# Altium project CourseEN.PrjPcb (part 1 of 2)
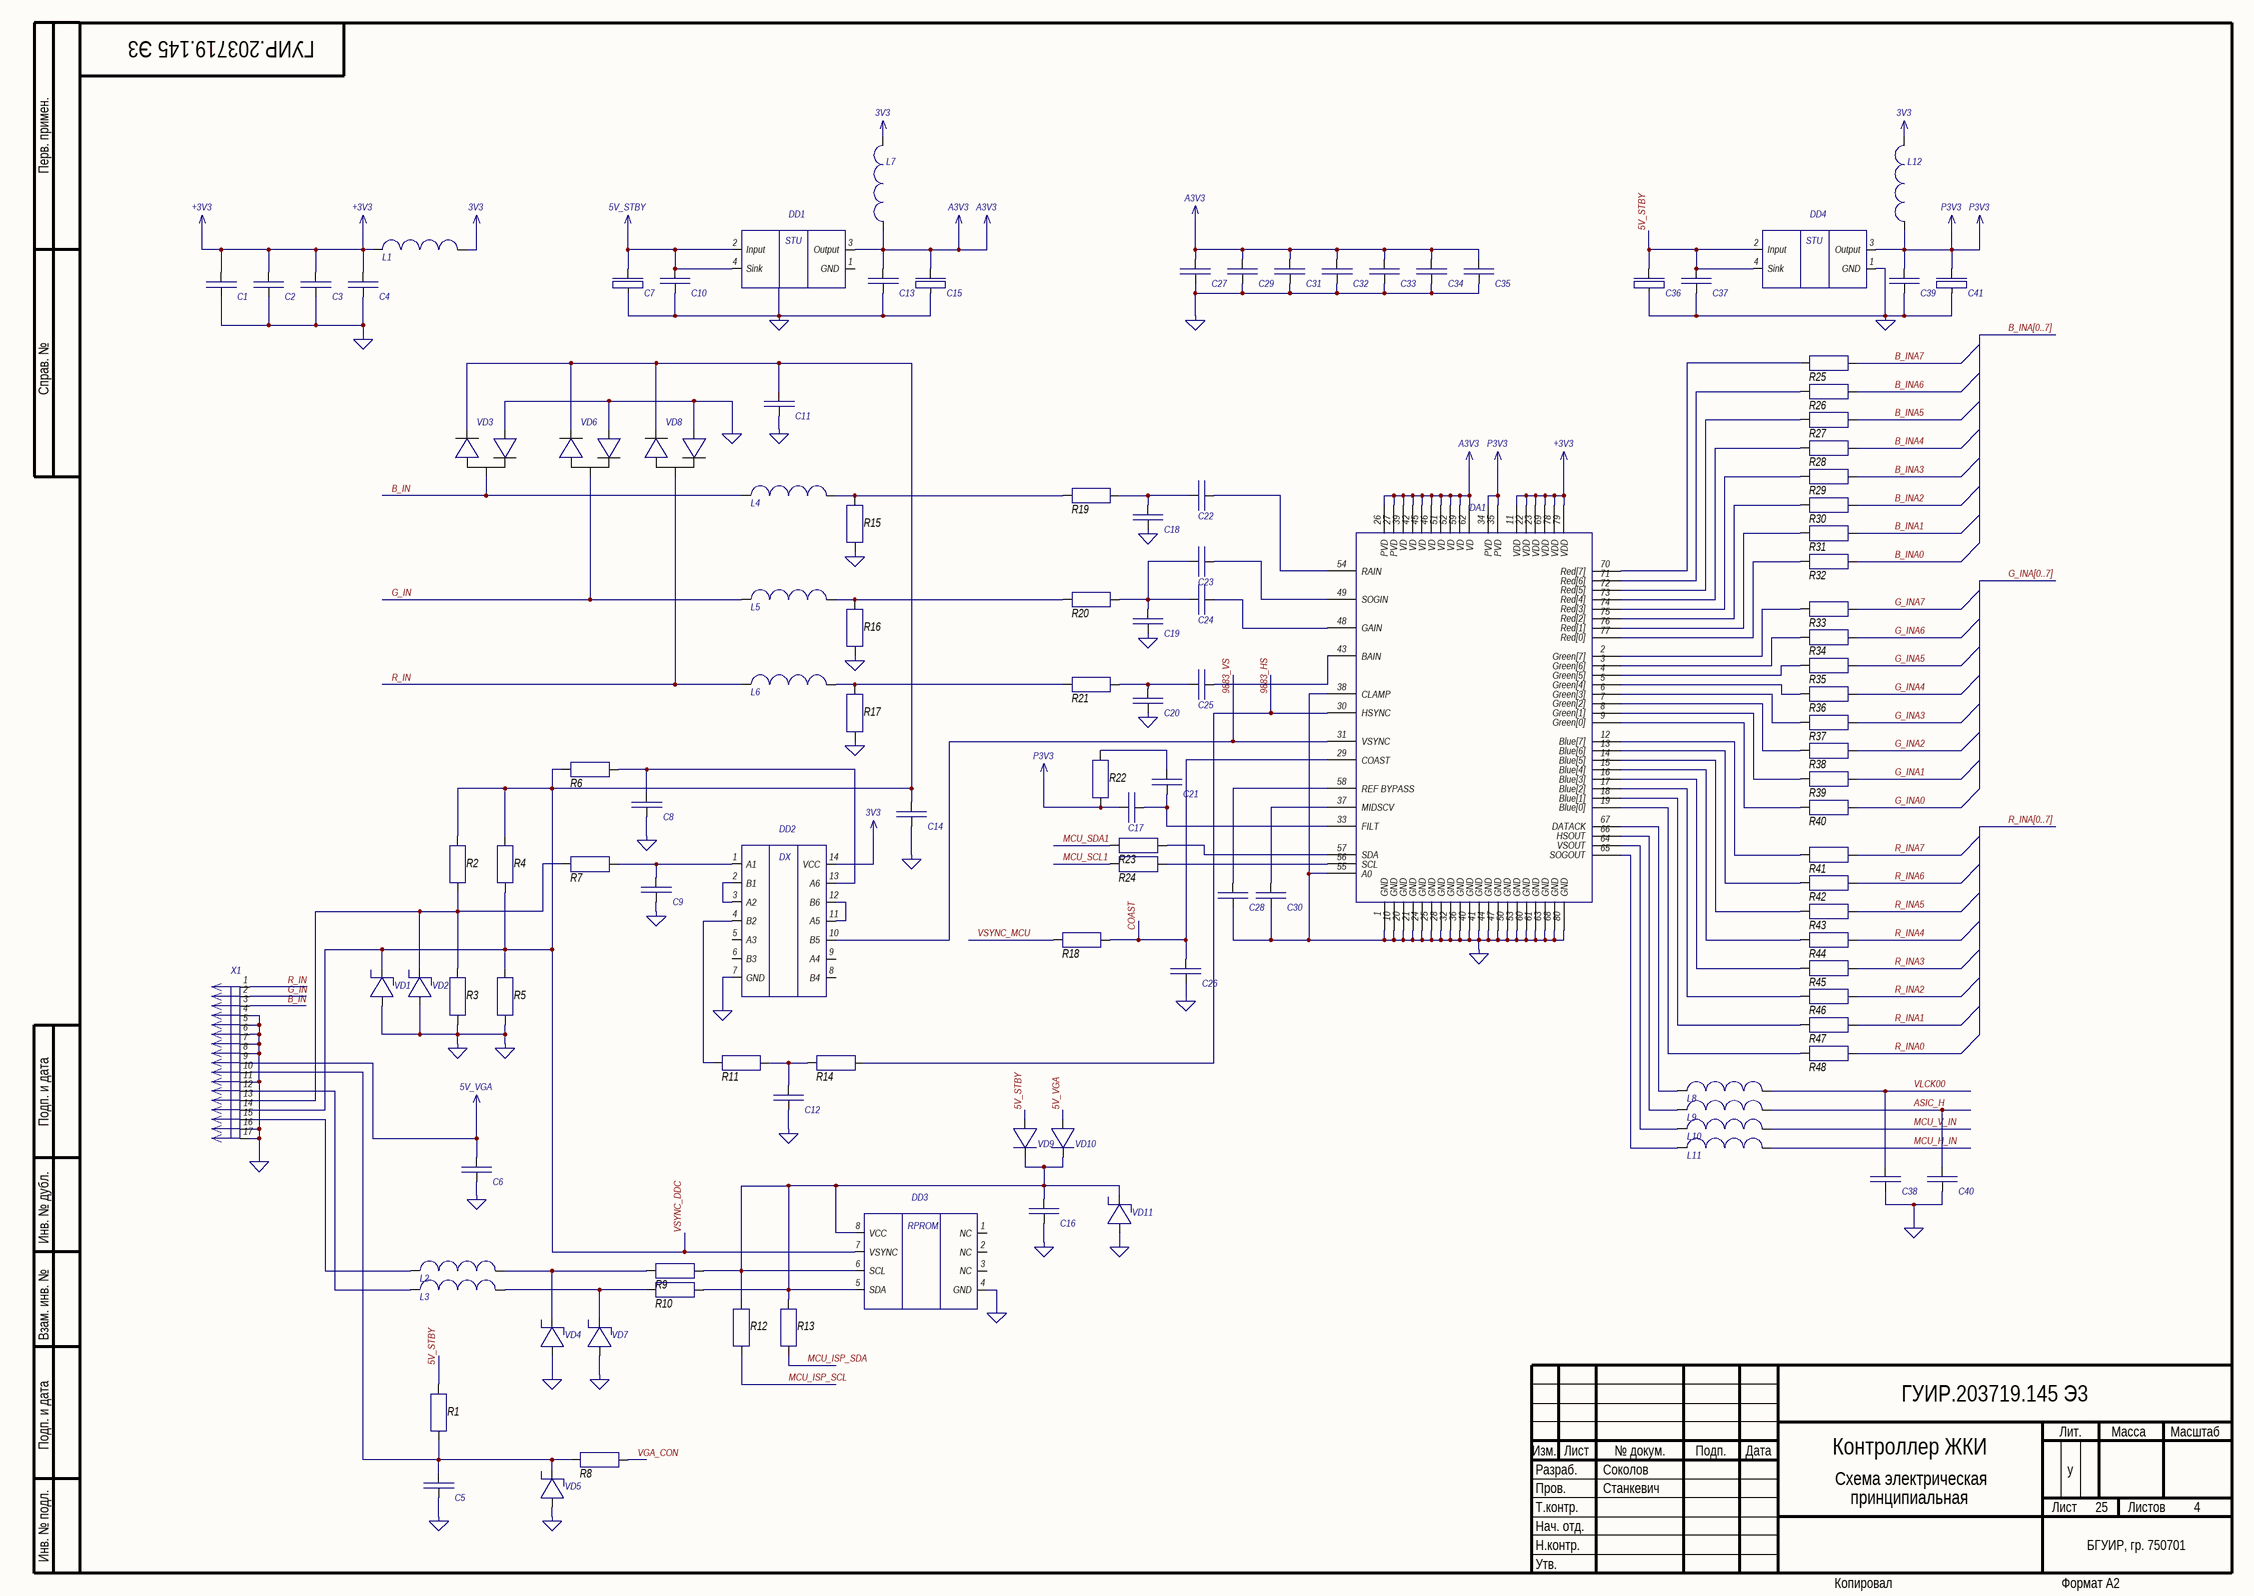
[diagram p0: 31.SchDoc]
4 sheets, 511 parts. Net scope: global (net labels, ports and power ports of the same name join across sheets).
Board files: PCB_with_drawing_try2.PcbDoc, PCB_assembly_drawing_try2.PcbDoc
Sheets:
  31.SchDoc
  32.SchDoc
  33.SchDoc
  36.SchDoc

## Sheet 31.SchDoc
size 594 x 420 mm; Scale: 1:1; Разраб.: Соколов; Обозначение документа: ГУИР.203719.145 Э3; Пров.: Станкевич; Номер листа: 25; Общее количество листов: 4; Литера: у; Наименование организации: БГУИР, гр. 750701; Наименование изделия 1: Контроллер ЖКИ; Наименование изделия 2: Схема электрическая; Наименование изделия 3: принципиальная; Нач. отд.: Нач. отд.

### Parts
C1  Capacitor  [cap_electro_13]  (value not drawn)
C2  Capacitor  [cap_electro_13]  (value not drawn)
C3  Capacitor  [cap_electro_13]  (value not drawn)
C4  Capacitor  [cap_electro_13]  (value not drawn)
C5  Capacitor  [cap_electro_13]  (value not drawn)
C6  Capacitor  [cap_electro_13]  (value not drawn)
C7  TuningCapacitor  [Cap_tantal_D]  (value not drawn)
C8  Capacitor  [cap_electro_13]  (value not drawn)
C9  Capacitor  [cap_electro_13]  (value not drawn)
C10  Capacitor  [cap_electro_13]  (value not drawn)
C11  Capacitor  [cap_electro_13]  (value not drawn)
C12  Capacitor  [cap_electro_13]  (value not drawn)
C13  Capacitor  [cap_electro_13]  (value not drawn)
C14  Capacitor  [cap_electro_13]  (value not drawn)
C15  TuningCapacitor  [Cap_tantal_D]  (value not drawn)
C16  Capacitor  [cap_electro_13]  (value not drawn)
C17  Capacitor  [cap_electro_13]  (value not drawn)
C18  Capacitor  [cap_electro_13]  (value not drawn)
C19  Capacitor  [cap_electro_13]  (value not drawn)
C20  Capacitor  [cap_electro_13]  (value not drawn)
C21  Capacitor  [cap_electro_13]  (value not drawn)
C22  Capacitor  [cap_electro_13]  (value not drawn)
C23  Capacitor  [cap_electro_13]  (value not drawn)
C24  Capacitor  [cap_electro_13]  (value not drawn)
C25  Capacitor  [cap_electro_13]  (value not drawn)
C26  Capacitor  [cap_electro_13]  (value not drawn)
C27  Capacitor  [cap_electro_13]  (value not drawn)
C28  Capacitor  [cap_electro_13]  (value not drawn)
C29  Capacitor  [cap_electro_13]  (value not drawn)
C30  Capacitor  [cap_electro_13]  (value not drawn)
C31  Capacitor  [cap_electro_13]  (value not drawn)
C32  Capacitor  [cap_electro_13]  (value not drawn)
C33  Capacitor  [cap_electro_13]  (value not drawn)
C34  Capacitor  [cap_electro_13]  (value not drawn)
C35  Capacitor  [cap_electro_13]  (value not drawn)
C36  TuningCapacitor  [Cap_tantal_D]  (value not drawn)
C37  Capacitor  [cap_electro_13]  (value not drawn)
C38  Capacitor  [cap_electro_13]  (value not drawn)
C39  Capacitor  [cap_electro_13]  (value not drawn)
C40  Capacitor  [cap_electro_13]  (value not drawn)
C41  TuningCapacitor  [Cap_tantal_D]  (value not drawn)
DA1  AD9883ABSTZ-140  [ST_80_2_ADI]  (value not drawn)
DD1  AIC1732  [AIC1732(SOT-89)]  (value not drawn)
DD2  74LVX14  [74LVX14(SO-14)]  (value not drawn)
DD3  24C21  [24Cxx]  (value not drawn)
DD4  AIC1732  [AIC1732(SOT-89)]  (value not drawn)
L1  Inductor  [inductor]  (value not drawn)
L2  Inductor  [inductor]  (value not drawn)
L3  Inductor  [inductor]  (value not drawn)
L4  Inductor  [inductor]  (value not drawn)
L5  Inductor  [inductor]  (value not drawn)
L6  Inductor  [inductor]  (value not drawn)
L7  Inductor  [inductor]  (value not drawn)
L8  Inductor  [inductor]  (value not drawn)
L9  Inductor  [inductor]  (value not drawn)
L10  Inductor  [inductor]  (value not drawn)
L11  Inductor  [inductor]  (value not drawn)
L12  Inductor  [inductor]  (value not drawn)
R1  Resistor  [R_1206]  (value not drawn)
R2  Resistor  [R_1206]  (value not drawn)
R3  Resistor  [R_1206]  (value not drawn)
R4  Resistor  [R_1206]  (value not drawn)
R5  Resistor  [R_1206]  (value not drawn)
R6  Resistor  [R_1206]  (value not drawn)
R7  Resistor  [R_1206]  (value not drawn)
R8  Resistor  [R_1206]  (value not drawn)
R9  Resistor  [R_1206]  (value not drawn)
R10  Resistor  [R_1206]  (value not drawn)
R11  Resistor  [R_1206]  (value not drawn)
R12  Resistor  [R_1206]  (value not drawn)
R13  Resistor  [R_1206]  (value not drawn)
R14  Resistor  [R_1206]  (value not drawn)
R15  Resistor  [R_1206]  (value not drawn)
R16  Resistor  [R_1206]  (value not drawn)
R17  Resistor  [R_1206]  (value not drawn)
R18  Resistor  [R_1206]  (value not drawn)
R19  Resistor  [R_1206]  (value not drawn)
R20  Resistor  [R_1206]  (value not drawn)
R21  Resistor  [R_1206]  (value not drawn)
R22  Resistor  [R_1206]  (value not drawn)
R23  Resistor  [R_1206]  (value not drawn)
R24  Resistor  [R_1206]  (value not drawn)
R25  Resistor  [R_1206]  (value not drawn)
R26  Resistor  [R_1206]  (value not drawn)
R27  Resistor  [R_1206]  (value not drawn)
R28  Resistor  [R_1206]  (value not drawn)
R29  Resistor  [R_1206]  (value not drawn)
R30  Resistor  [R_1206]  (value not drawn)
R31  Resistor  [R_1206]  (value not drawn)
R32  Resistor  [R_1206]  (value not drawn)
R33  Resistor  [R_1206]  (value not drawn)
R34  Resistor  [R_1206]  (value not drawn)
R35  Resistor  [R_1206]  (value not drawn)
R36  Resistor  [R_1206]  (value not drawn)
R37  Resistor  [R_1206]  (value not drawn)
R38  Resistor  [R_1206]  (value not drawn)
R39  Resistor  [R_1206]  (value not drawn)
R40  Resistor  [R_1206]  (value not drawn)
R41  Resistor  [R_1206]  (value not drawn)
R42  Resistor  [R_1206]  (value not drawn)
R43  Resistor  [R_1206]  (value not drawn)
R44  Resistor  [R_1206]  (value not drawn)
R45  Resistor  [R_1206]  (value not drawn)
R46  Resistor  [R_1206]  (value not drawn)
R47  Resistor  [R_1206]  (value not drawn)
R48  Resistor  [R_1206]  (value not drawn)
VD1  DiodeSchottky  [zener_diode]  (value not drawn)
VD2  DiodeSchottky  [zener_diode]  (value not drawn)
VD3  BAV99  [BAV99]  (value not drawn)
VD4  DiodeSchottky  [zener_diode]  (value not drawn)
VD5  DiodeSchottky  [zener_diode]  (value not drawn)
VD6  BAV99  [BAV99]  (value not drawn)
VD7  DiodeSchottky  [zener_diode]  (value not drawn)
VD8  BAV99  [BAV99]  (value not drawn)
VD9  Diode  [zener_diode]  (value not drawn)
VD10  Diode  [zener_diode]  (value not drawn)
VD11  DiodeSchottky  [zener_diode]  (value not drawn)
X1  DB-15  [VGA]  (value not drawn)

### Nets
3V3: DD2.14(VCC) L1.2 L7.2 L12.2
5V_STBY: C7.1 C10.1 C36.1 C37.1 DD1.2(Input) DD1.4(Sink) DD4.2(Input) DD4.4(Sink) R1.2 VD9.1
5V_VGA: C6.2 VD10.1 X1.9
+3V3: C1.1 C2.1 C3.1 C4.1 DA1.11(VDD) DA1.22(VDD) DA1.23(VDD) DA1.69(VDD) DA1.78(VDD) DA1.79(VDD) L1.1
A3V3: C13.1 C15.1 C27.1 C29.1 C31.1 C32.1 C33.1 C34.1 C35.1 DA1.26(PVD) DA1.27(PVD) DA1.39(VD) DA1.42(VD) DA1.45(VD) DA1.46(VD) DA1.51(VD) DA1.52(VD) DA1.59(VD) DA1.62(VD) DD1.3(Output) L7.1
ASIC_H: C40.1 L9.2
GND: C1.2 C2.2 C3.2 C4.2 C5.2 C6.1 C7.2 C8.2 C9.2 C10.2 C11.2 C12.2 C13.2 C14.2 C15.2 C16.2 C18.2 C19.2 C20.2 C26.1 C27.2 C28.1 C29.2 C30.1 C31.2 C32.2 C33.2 C34.2 C35.2 C36.2 C37.2 C38.2 C39.2 C40.2 C41.2 DA1.1(GND) DA1.10(GND) DA1.20(GND) DA1.21(GND) DA1.24(GND) DA1.25(GND) DA1.28(GND) DA1.32(GND) DA1.36(GND) DA1.38(CLAMP) DA1.40(GND) DA1.41(GND) DA1.44(GND) DA1.47(GND) DA1.50(GND) DA1.53(GND) DA1.55(A0) DA1.60(GND) DA1.61(GND) DA1.63(GND) DA1.68(GND) DA1.80(GND) DD2.7(GND) DD3.4(GND) DD4.1(GND) R3.1 R5.1 R15.1 R16.1 R17.1 VD1.1 VD2.1 VD3.1 VD4.1 VD5.1 VD6.1 VD7.1 VD8.1 VD11.1 X1.4 X1.5 X1.6 X1.7 X1.8 X1.11 X1.16 X1.17
MCU_H_IN: L11.2
MCU_V_IN: L10.2
P3V3: C17.2 C39.1 C41.1 DA1.34(PVD) DA1.35(PVD) DD4.3(Output) L12.1 R22.1
VSYNC_MCU: R18.1
9883_HS: DA1.30(HSYNC) R14.2
9883_VS: DA1.31(VSYNC) DD2.10(B5)
B_IN: L4.1 VD3.3 X1.3
B_INA0: R32.2
B_INA1: R31.2
B_INA2: R30.2
B_INA3: R29.2
B_INA4: R28.2
B_INA5: R27.2
B_INA6: R26.2
B_INA7: R25.2
COAST: C26.2 DA1.29(COAST) R18.2
G_IN: L5.1 VD6.3 X1.2
G_INA0: R40.2
G_INA1: R39.2
G_INA2: R38.2
G_INA3: R37.2
G_INA4: R36.2
G_INA5: R35.2
G_INA6: R34.2
G_INA7: R33.2
MCU_ISP_SCL: R12.1
MCU_ISP_SDA: R13.1
MCU_SCL1: R24.1
MCU_SDA1: R23.1
R_IN: L6.1 VD8.3 X1.1
R_INA0: R48.2
R_INA1: R47.2
R_INA2: R46.2
R_INA3: R45.2
R_INA4: R44.2
R_INA5: R43.2
R_INA6: R42.2
R_INA7: R41.2
VGA_CON: R8.2
VLCK00: C38.1 L8.2
VSYNC_DDC: C11.1 C14.1 DD3.7(VSYNC) R2.2 R4.1 R4.2 R5.2 R6.1 VD1.2 VD3.2 VD6.2 VD8.2 X1.14
NetC5_1: C5.1 R1.1 R8.1 VD5.2 X1.10
NetC8_1: C8.1 DD2.13(A6) R6.2
NetC9_1: C9.1 DD2.1(A1) R7.2
NetC12_1: C12.1 R11.2 R14.1
NetC16_1: C16.1 DD3.5(SDA) DD3.6(SCL) DD3.8(VCC) R9.2 R10.2 R12.2 R13.2 VD9.2 VD10.2 VD11.2
NetC17_1: C17.1 C21.1 DA1.33(FILT)
NetC18_1: C18.1 C22.2 R19.2
NetC19_1: C19.1 C23.2 C24.2 R20.2
NetC20_1: C20.1 C25.2 R21.2
NetC21_2: C21.2 R22.2
NetC22_1: C22.1 DA1.54(RAIN)
NetC23_1: C23.1 DA1.49(SOGIN)
NetC24_1: C24.1 DA1.48(GAIN)
NetC25_1: C25.1 DA1.43(BAIN)
NetC28_2: C28.2 DA1.58(REF_BYPASS)
NetC30_2: C30.2 DA1.37(MIDSCV)
NetDA1_2: DA1.2(Green[7]) R33.1
NetDA1_3: DA1.3(Green[6]) R34.1
NetDA1_4: DA1.4(Green[5]) R35.1
NetDA1_5: DA1.5(Green[4]) R36.1
NetDA1_6: DA1.6(Green[3]) R37.1
NetDA1_7: DA1.7(Green[2]) R38.1
NetDA1_8: DA1.8(Green[1]) R39.1
NetDA1_9: DA1.9(Green[0]) R40.1
NetDA1_12: DA1.12(Blue[7]) R41.1
NetDA1_13: DA1.13(Blue[6]) R42.1
NetDA1_14: DA1.14(Blue[5]) R43.1
NetDA1_15: DA1.15(Blue[4]) R44.1
NetDA1_16: DA1.16(Blue[3]) R45.1
NetDA1_17: DA1.17(Blue[2]) R46.1
NetDA1_18: DA1.18(Blue[1]) R47.1
NetDA1_19: DA1.19(Blue[0]) R48.1
NetDA1_56: DA1.56(SCL) R24.2
NetDA1_57: DA1.57(SDA) R23.2
NetDA1_64: DA1.64(VSOUT) L10.1
NetDA1_65: DA1.65(SOGOUT) L11.1
NetDA1_66: DA1.66(HSOUT) L9.1
NetDA1_67: DA1.67(DATACK) L8.1
NetDA1_70: DA1.70(Red[7]) R25.1
NetDA1_71: DA1.71(Red[6]) R26.1
NetDA1_72: DA1.72(Red[5]) R27.1
NetDA1_73: DA1.73(Red[4]) R28.1
NetDA1_74: DA1.74(Red[3]) R29.1
NetDA1_75: DA1.75(Red[2]) R30.1
NetDA1_76: DA1.76(Red[1]) R31.1
NetDA1_77: DA1.77(Red[0]) R32.1
NetDD2_2: DD2.2(B1) DD2.3(A2)
NetDD2_4: DD2.4(B2) R11.1
NetDD2_11: DD2.11(A5) DD2.12(B6)
NetL2_1: L2.1 X1.15
NetL2_2: L2.2 R9.1 VD4.2
NetL3_1: L3.1 X1.12
NetL3_2: L3.2 R10.1 VD7.2
NetL4_2: L4.2 R15.2 R19.1
NetL5_2: L5.2 R16.2 R20.1
NetL6_2: L6.2 R17.2 R21.1
NetR2_1: R2.1 R3.2 R7.1 VD2.2 X1.13

Not connected (* = marked no-connect by the designer): DD1 1(GND); DD2 5(A3) 6(B3) 8(B4) 9(A4); DD3 1(NC) 2(NC) 3(NC)

### Buses and harness runs
bus B_INA[0..7]
bus G_INA[0..7]
bus R_INA[0..7]

### Notes on the sheet
- Перв. примен.
- Справ. №
- Подп. и дата
- Инв. № дубл.
- Взам. инв. №
- Разраб.
- Изм.
- Лист
- № докум.
- Подп.
- Дата
- Лит.
- Масса
- Масштаб
- Пров.
- Т.контр.
- Листов
- Инв. № подл.
- Утв.
- Н.контр.
- Копировал
- Формат А2
- (in symbol 24C21) RPROM
- (in symbol 74LVX14) DX
- (in symbol AIC1732) STU

### Library data of the parts
DA1 = AD9883ABSTZ-140: Built_By: EMA_UL_Team; Vendor: Analog Devices Inc; SourceLibrary: Analog_2012-01-01_6; Manufacturer_Part_Number: AD9883ABSTZ-140; Copyright: Copyright (C) 2018 Accelerated Designs. All rights reserved; RefDes: RefDes; Type: DEV
X1 = VGA_connector

## Sheet 32.SchDoc
size 594 x 420 mm; Scale: 1:1; Разраб.: Иванов; Обозначение документа: ГУИР.203719.145 Э3; Пров.: Петров; Утв.: Сидоров; Номер листа: 26; Наименование организации: ОАО "Концерн "МПО-Гидроприбор"; Наименование изделия 1: Плата; Наименование изделия 2: Схема электрическая; Наименование изделия 3: принципиальная; Нач. отд.: Нач. отд.; Фамилия нач. отд.: Сидоров
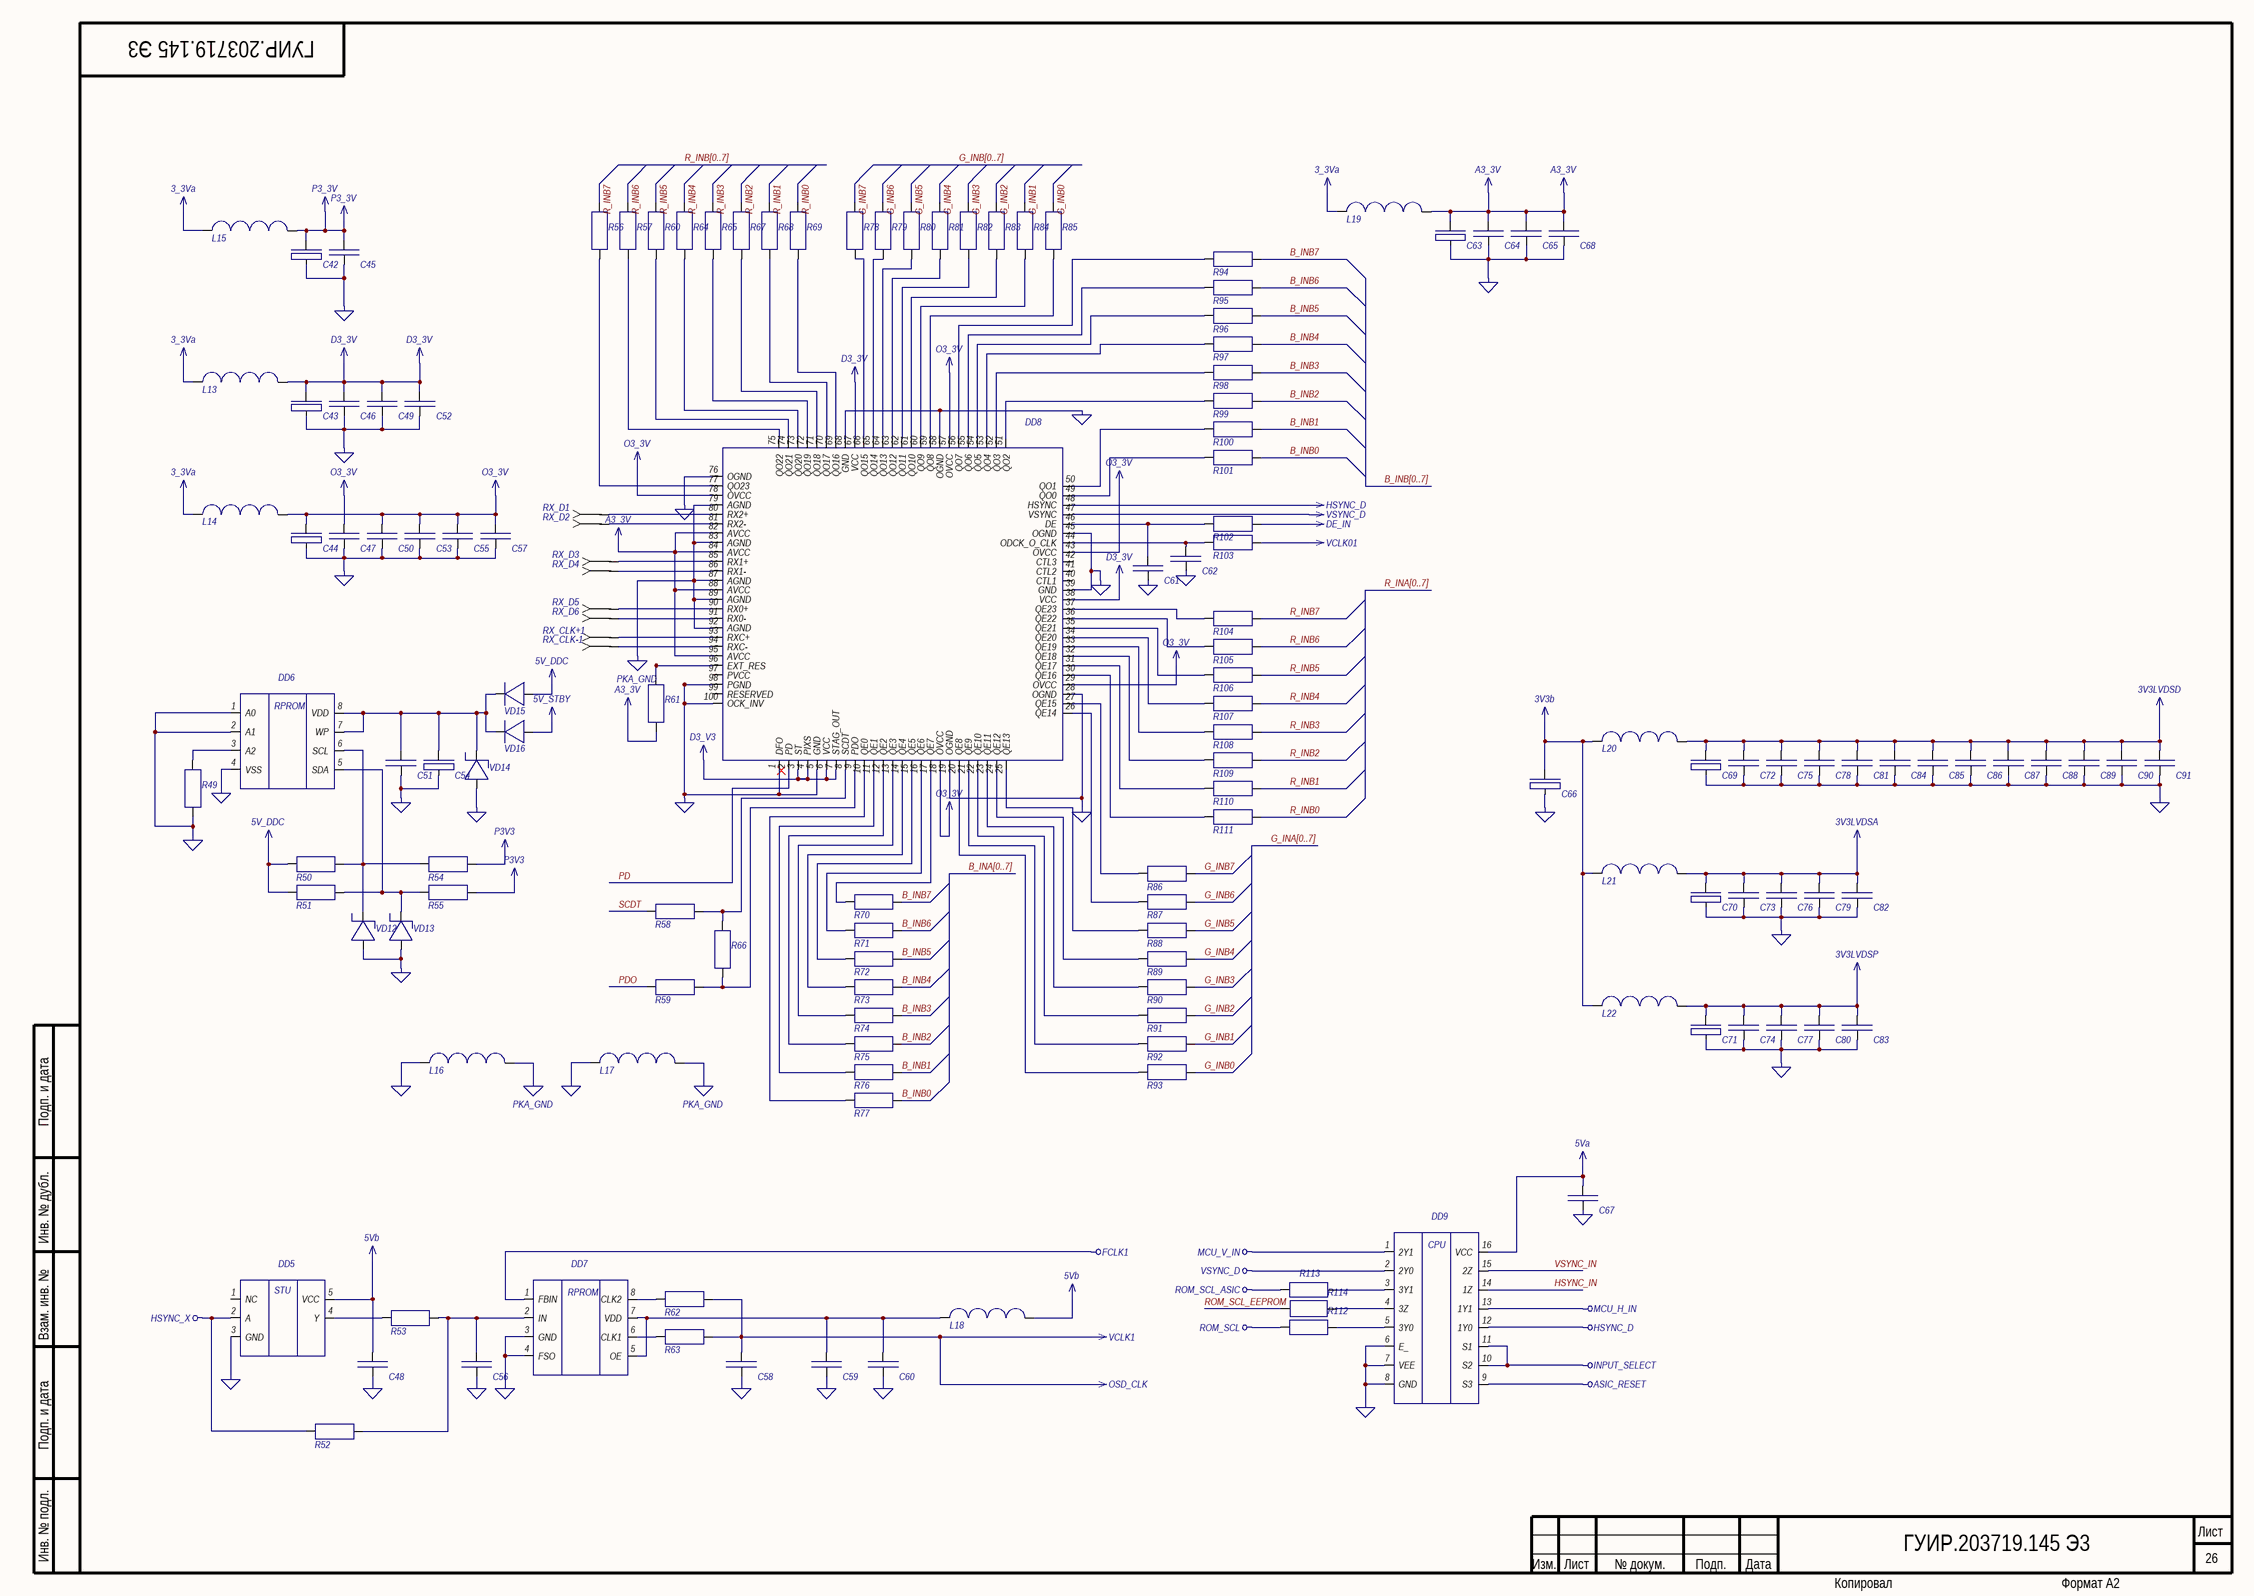
[diagram p1: 32.SchDoc]

### Parts
C42  TuningCapacitor  [Cap_tantal_D]  (value not drawn)
C43  TuningCapacitor  [Cap_tantal_D]  (value not drawn)
C44  TuningCapacitor  [Cap_tantal_D]  (value not drawn)
C45  Capacitor  [cap_electro_13]  (value not drawn)
C46  Capacitor  [cap_electro_13]  (value not drawn)
C47  Capacitor  [cap_electro_13]  (value not drawn)
C48  Capacitor  [cap_electro_13]  (value not drawn)
C49  Capacitor  [cap_electro_13]  (value not drawn)
C50  Capacitor  [cap_electro_13]  (value not drawn)
C51  Capacitor  [cap_electro_13]  (value not drawn)
C52  Capacitor  [cap_electro_13]  (value not drawn)
C53  Capacitor  [cap_electro_13]  (value not drawn)
C54  TuningCapacitor  [Cap_tantal_D]  (value not drawn)
C55  Capacitor  [cap_electro_13]  (value not drawn)
C56  Capacitor  [cap_electro_13]  (value not drawn)
C57  Capacitor  [cap_electro_13]  (value not drawn)
C58  Capacitor  [cap_electro_13]  (value not drawn)
C59  Capacitor  [cap_electro_13]  (value not drawn)
C60  Capacitor  [cap_electro_13]  (value not drawn)
C61  Capacitor  [cap_electro_13]  (value not drawn)
C62  Capacitor  [cap_electro_13]  (value not drawn)
C63  TuningCapacitor  [Cap_tantal_D]  (value not drawn)
C64  Capacitor  [cap_electro_13]  (value not drawn)
C65  Capacitor  [cap_electro_13]  (value not drawn)
C66  TuningCapacitor  [Cap_tantal_D]  (value not drawn)
C67  Capacitor  [cap_electro_13]  (value not drawn)
C68  Capacitor  [cap_electro_13]  (value not drawn)
C69  TuningCapacitor  [Cap_tantal_D]  (value not drawn)
C70  TuningCapacitor  [Cap_tantal_D]  (value not drawn)
C71  TuningCapacitor  [Cap_tantal_D]  (value not drawn)
C72  Capacitor  [cap_electro_13]  (value not drawn)
C73  Capacitor  [cap_electro_13]  (value not drawn)
C74  Capacitor  [cap_electro_13]  (value not drawn)
C75  Capacitor  [cap_electro_13]  (value not drawn)
C76  Capacitor  [cap_electro_13]  (value not drawn)
C77  Capacitor  [cap_electro_13]  (value not drawn)
C78  Capacitor  [cap_electro_13]  (value not drawn)
C79  Capacitor  [cap_electro_13]  (value not drawn)
C80  Capacitor  [cap_electro_13]  (value not drawn)
C81  Capacitor  [cap_electro_13]  (value not drawn)
C82  Capacitor  [cap_electro_13]  (value not drawn)
C83  Capacitor  [cap_electro_13]  (value not drawn)
C84  Capacitor  [cap_electro_13]  (value not drawn)
C85  Capacitor  [cap_electro_13]  (value not drawn)
C86  Capacitor  [cap_electro_13]  (value not drawn)
C87  Capacitor  [cap_electro_13]  (value not drawn)
C88  Capacitor  [cap_electro_13]  (value not drawn)
C89  Capacitor  [cap_electro_13]  (value not drawn)
C90  Capacitor  [cap_electro_13]  (value not drawn)
C91  Capacitor  [cap_electro_13]  (value not drawn)
DD5  F14-SINGLE  [74AHC1G14(SOT25)]  (value not drawn)
DD6  24C02  [24Cxx]  (value not drawn)
DD7  AV9173-01  [AV9173-01(DIP8)]  (value not drawn)
DD8  SIL151  [SIL151]  (value not drawn)
DD9  74LV4053  [74LV4053(SOT38-4)]  (value not drawn)
L13  Inductor  [inductor]  (value not drawn)
L14  Inductor  [inductor]  (value not drawn)
L15  Inductor  [inductor]  (value not drawn)
L16  Inductor  [inductor]  (value not drawn)
L17  Inductor  [inductor]  (value not drawn)
L18  Inductor  [inductor]  (value not drawn)
L19  Inductor  [inductor]  (value not drawn)
L20  Inductor  [inductor]  (value not drawn)
L21  Inductor  [inductor]  (value not drawn)
L22  Inductor  [inductor]  (value not drawn)
R49  Resistor  [R_1206]  (value not drawn)
R50  Resistor  [R_1206]  (value not drawn)
R51  Resistor  [R_1206]  (value not drawn)
R52  Resistor  [R_1206]  (value not drawn)
R53  Resistor  [R_1206]  (value not drawn)
R54  Resistor  [R_1206]  (value not drawn)
R55  Resistor  [R_1206]  (value not drawn)
R56  Resistor  [R_1206]  (value not drawn)
R57  Resistor  [R_1206]  (value not drawn)
R58  Resistor  [R_1206]  (value not drawn)
R59  Resistor  [R_1206]  (value not drawn)
R60  Resistor  [R_1206]  (value not drawn)
R61  Resistor  [R_1206]  (value not drawn)
R62  Resistor  [R_1206]  (value not drawn)
R63  Resistor  [R_1206]  (value not drawn)
R64  Resistor  [R_1206]  (value not drawn)
R65  Resistor  [R_1206]  (value not drawn)
R66  Resistor  [R_1206]  (value not drawn)
R67  Resistor  [R_1206]  (value not drawn)
R68  Resistor  [R_1206]  (value not drawn)
R69  Resistor  [R_1206]  (value not drawn)
R70  Resistor  [R_1206]  (value not drawn)
R71  Resistor  [R_1206]  (value not drawn)
R72  Resistor  [R_1206]  (value not drawn)
R73  Resistor  [R_1206]  (value not drawn)
R74  Resistor  [R_1206]  (value not drawn)
R75  Resistor  [R_1206]  (value not drawn)
R76  Resistor  [R_1206]  (value not drawn)
R77  Resistor  [R_1206]  (value not drawn)
R78  Resistor  [R_1206]  (value not drawn)
R79  Resistor  [R_1206]  (value not drawn)
R80  Resistor  [R_1206]  (value not drawn)
R81  Resistor  [R_1206]  (value not drawn)
R82  Resistor  [R_1206]  (value not drawn)
R83  Resistor  [R_1206]  (value not drawn)
R84  Resistor  [R_1206]  (value not drawn)
R85  Resistor  [R_1206]  (value not drawn)
R86  Resistor  [R_1206]  (value not drawn)
R87  Resistor  [R_1206]  (value not drawn)
R88  Resistor  [R_1206]  (value not drawn)
R89  Resistor  [R_1206]  (value not drawn)
R90  Resistor  [R_1206]  (value not drawn)
R91  Resistor  [R_1206]  (value not drawn)
R92  Resistor  [R_1206]  (value not drawn)
R93  Resistor  [R_1206]  (value not drawn)
R94  Resistor  [R_1206]  (value not drawn)
R95  Resistor  [R_1206]  (value not drawn)
R96  Resistor  [R_1206]  (value not drawn)
R97  Resistor  [R_1206]  (value not drawn)
R98  Resistor  [R_1206]  (value not drawn)
R99  Resistor  [R_1206]  (value not drawn)
R100  Resistor  [R_1206]  (value not drawn)
R101  Resistor  [R_1206]  (value not drawn)
R102  Resistor  [R_1206]  (value not drawn)
R103  Resistor  [R_1206]  (value not drawn)
R104  Resistor  [R_1206]  (value not drawn)
R105  Resistor  [R_1206]  (value not drawn)
R106  Resistor  [R_1206]  (value not drawn)
R107  Resistor  [R_1206]  (value not drawn)
R108  Resistor  [R_1206]  (value not drawn)
R109  Resistor  [R_1206]  (value not drawn)
R110  Resistor  [R_1206]  (value not drawn)
R111  Resistor  [R_1206]  (value not drawn)
R112  Resistor  [R_1206]  (value not drawn)
R113  Resistor  [R_1206]  (value not drawn)
R114  Resistor  [R_1206]  (value not drawn)
RX_CLK+1  InputArrow  [ARROW]  (value not drawn)
RX_CLK-1  InputArrow  [ARROW]  (value not drawn)
RX_D1  InputArrow  [ARROW]  (value not drawn)
RX_D2  InputArrow  [ARROW]  (value not drawn)
RX_D3  InputArrow  [ARROW]  (value not drawn)
RX_D4  InputArrow  [ARROW]  (value not drawn)
RX_D5  InputArrow  [ARROW]  (value not drawn)
RX_D6  InputArrow  [ARROW]  (value not drawn)
VD12  DiodeSchottky  [zener_diode]  (value not drawn)
VD13  DiodeSchottky  [zener_diode]  (value not drawn)
VD14  DiodeSchottky  [zener_diode]  (value not drawn)
VD15  Diode  [zener_diode]  (value not drawn)
VD16  Diode  [zener_diode]  (value not drawn)

### Nets
3_3Va: L13.1 L14.1 L15.1 L19.1
3V3b: C66.1 L20.1 L21.1 L22.1
3V3LVDSA: C70.1 C73.2 C76.2 C79.2 C82.2 L21.2
3V3LVDSD: C69.1 C72.2 C75.2 C78.2 C81.2 C84.2 C85.2 C86.2 C87.2 C88.2 C89.2 C90.2 C91.2 L20.2
3V3LVDSP: C71.1 C74.2 C77.2 C80.2 C83.2 L22.2
5V_DDC: R50.2 R51.2 VD15.1
5V_STBY: VD16.1
5Va: C67.2 DD9.16(VCC)
5Vb: C48.1 DD5.5(VCC) L18.2
A3_3V: C63.1 C64.2 C65.2 C68.2 DD8.82(AVCC) DD8.84(AVCC) DD8.88(AVCC) DD8.95(AVCC) L19.2 R61.1
ASIC_RESET: DD9.9(S3)
D3_3V: C43.1 C46.2 C49.2 C52.2 DD8.38(VCC) DD8.67(VCC) L13.2
D3_V3: DD8.3(ST) DD8.4(PIXS) DD8.6(VCC) DD8.7(STAG_OUT)
DE_IN: R102.2
FCLK1: DD7.1(FBIN)
GND: C42.2 C43.2 C44.2 C45.1 C46.1 C47.1 C48.2 C49.1 C50.1 C51.1 C52.1 C53.1 C54.2 C55.1 C56.2 C57.1 C58.2 C59.2 C60.2 C61.1 C62.1 C63.2 C64.1 C65.1 C66.2 C67.1 C68.1 C69.2 C70.2 C71.2 C72.1 C73.1 C74.1 C75.1 C76.1 C77.1 C78.1 C79.1 C80.1 C81.1 C82.1 C83.1 C84.1 C85.1 C86.1 C87.1 C88.1 C89.1 C90.1 C91.1 DD5.3(GND) DD6.1(A0) DD6.2(A1) DD6.4(VSS) DD7.3(GND) DD7.4(FSO) DD8.1(DFO) DD8.5(GND) DD8.19(OGND) DD8.28(OGND) DD8.39(GND) DD8.45(OGND) DD8.58(OGND) DD8.68(GND) DD8.76(OGND) DD8.98(PGND) DD8.100(OCK_INV) DD9.6(E_) DD9.7(VEE) DD9.8(GND) L16.1 L17.1 R49.1 VD12.1 VD13.1 VD14.1
HSYNC_D: DD8.48(HSYNC) DD9.12(1Y0)
HSYNC_X: DD5.2(A) R52.1
INPUT_SELECT: DD9.10(S2) DD9.11(S1)
MCU_H_IN: DD9.13(1Y1)
MCU_V_IN: DD9.1(2Y1)
O3_3V: C44.1 C47.2 C50.2 C53.2 C55.2 C57.2 DD8.18(OVCC) DD8.29(OVCC) DD8.43(OVCC) DD8.57(OVCC) DD8.78(OVCC) L14.2
OSD_CLK: C58.1 R62.2 R63.2  [also labelled VCLK1]
P3_3V: C42.1 C45.2 L15.2
P3V3: R54.1 R55.1
PKA_GND: DD8.79(AGND) DD8.83(AGND) DD8.87(AGND) DD8.89(AGND) DD8.92(AGND) L16.2 L17.2
ROM_SCL: R112.1
ROM_SCL_ASIC: R113.1
VCLK01: R103.2
VSYNC_D: DD8.47(VSYNC) DD9.2(2Y0)
B_INB0: R77.2 R101.2
B_INB1: R76.2 R100.2
B_INB2: R75.2 R99.2
B_INB3: R74.2 R98.2
B_INB4: R73.2 R97.2
B_INB5: R72.2 R96.2
B_INB6: R71.2 R95.2
B_INB7: R70.2 R94.2
G_INB0: R85.2 R93.2
G_INB1: R84.2 R92.2
G_INB2: R83.2 R91.2
G_INB3: R82.2 R90.2
G_INB4: R81.2 R89.2  [also labelled G_INB[0..7]]
G_INB5: R80.2 R88.2
G_INB6: R79.2 R87.2
G_INB7: R78.2 R86.2
HSYNC_IN: DD9.14(1Z)
PD: DD8.2(PD)
PDO: R59.2
R_INB0: R69.2 R111.2
R_INB1: R68.2 R110.2
R_INB2: R67.2 R109.2
R_INB3: R65.2 R108.2
R_INB4: R64.2 R107.2
R_INB5: R60.2 R106.2
R_INB6: R57.2 R105.2
R_INB7: R56.2 R104.2
ROM_SCL_EEPROM: R114.2
SCDT: R58.2
VSYNC_IN: DD9.15(2Z)
NetC51_2: C51.2 C54.1 DD6.7(WP) DD6.8(VDD) VD14.2 VD15.2 VD16.2
NetC56_1: C56.1 DD7.2(IN) R52.2 R53.2
NetC59_1: C59.1 C60.1 DD7.5(OE) DD7.7(VDD) L18.1
NetC61_2: C61.2 DD8.46(DE) R102.1
NetC62_2: C62.2 DD8.44(ODCK_O_CLK) R103.1
NetDD5_4: DD5.4(Y) R53.1
NetDD6_3: DD6.3(A2) R49.2
NetDD6_5: DD6.5(SDA) R51.1 R55.2 VD13.2
NetDD6_6: DD6.6(SCL) R50.1 R54.2 VD12.2
NetDD7_6: DD7.6(CLK1) R63.1
NetDD7_8: DD7.8(CLK2) R62.1
NetDD8_8: DD8.8(SCDT) R58.1 R66.2
NetDD8_9: DD8.9(PDO) R59.1 R66.1
NetDD8_10: DD8.10(QE0) R77.1
NetDD8_11: DD8.11(QE1) R76.1
NetDD8_12: DD8.12(QE2) R75.1
NetDD8_13: DD8.13(QE3) R74.1
NetDD8_14: DD8.14(QE4) R73.1
NetDD8_15: DD8.15(QE5) R72.1
NetDD8_16: DD8.16(QE6) R71.1
NetDD8_17: DD8.17(QE7) R70.1
NetDD8_20: DD8.20(QE8) R93.1
NetDD8_21: DD8.21(QE9) R92.1
NetDD8_22: DD8.22(QE10) R91.1
NetDD8_23: DD8.23(QE11) R90.1
NetDD8_24: DD8.24(QE12) R89.1
NetDD8_25: DD8.25(QE13) R88.1
NetDD8_26: DD8.26(QE14) R87.1
NetDD8_27: DD8.27(QE15) R86.1
NetDD8_30: DD8.30(QE16) R111.1
NetDD8_31: DD8.31(QE17) R110.1
NetDD8_32: DD8.32(QE18) R109.1
NetDD8_33: DD8.33(QE19) R108.1
NetDD8_34: DD8.34(QE20) R107.1
NetDD8_35: DD8.35(QE21) R106.1
NetDD8_36: DD8.36(QE22) R105.1
NetDD8_37: DD8.37(QE23) R104.1
NetDD8_49: DD8.49(QO0) R101.1
NetDD8_50: DD8.50(QO1) R100.1
NetDD8_51: DD8.51(QO2) R99.1
NetDD8_52: DD8.52(QO3) R98.1
NetDD8_53: DD8.53(QO4) R97.1
NetDD8_54: DD8.54(QO5) R96.1
NetDD8_55: DD8.55(QO6) R95.1
NetDD8_56: DD8.56(QO7) R94.1
NetDD8_59: DD8.59(QO8) R85.1
NetDD8_60: DD8.60(QO9) R84.1
NetDD8_61: DD8.61(QO10) R83.1
NetDD8_62: DD8.62(QO11) R82.1
NetDD8_63: DD8.63(QO12) R81.1
NetDD8_64: DD8.64(QO13) R80.1
NetDD8_65: DD8.65(QO14) R79.1
NetDD8_66: DD8.66(QO15) R78.1
NetDD8_69: DD8.69(QO16) R69.1
NetDD8_70: DD8.70(QO17) R68.1
NetDD8_71: DD8.71(QO18) R67.1
NetDD8_72: DD8.72(QO19) R65.1
NetDD8_73: DD8.73(QO20) R64.1
NetDD8_74: DD8.74(QO21) R60.1
NetDD8_75: DD8.75(QO22) R57.1
NetDD8_77: DD8.77(QO23) R56.1
NetDD8_80: DD8.80(RX2+) RX_D1.1
NetDD8_81: DD8.81(RX2-) RX_D2.1
NetDD8_85: DD8.85(RX1+) RX_D3.1
NetDD8_86: DD8.86(RX1-) RX_D4.1
NetDD8_90: DD8.90(RX0+) RX_D5.1
NetDD8_91: DD8.91(RX0-) RX_D6.1
NetDD8_93: DD8.93(RXC+) RX_CLK+1.1
NetDD8_94: DD8.94(RXC-) RX_CLK-1.1
NetDD8_96: DD8.96(EXT_RES) R61.2
NetDD9_3: DD9.3(3Y1) R113.2
NetDD9_4: DD9.4(3Z) R114.1
NetDD9_5: DD9.5(3Y0) R112.2

Not connected (* = marked no-connect by the designer): DD5 1(NC); DD8 40(CTL1) 41(CTL2) 42(CTL3) 97(PVCC) 99(RESERVED)

### Buses and harness runs
bus B_INA[0..7]
bus B_INB[0..7]
bus G_INA[0..7]
bus R_INA[0..7]
bus R_INB[0..7]

### Notes on the sheet
- Подп. и дата
- Инв. № дубл.
- Взам. инв. №
- Инв. № подл.
- Изм.
- Лист
- № докум.
- Подп.
- Дата
- Копировал
- Формат А2
- (in symbol 24C02) RPROM
- (in symbol 74AHC1G14-TA) STU
- (in symbol 74LV4053) CPU
- (in symbol AV9173-01) RPROM

### Library data of the parts
DD5 = 74AHC1G14-TA

## Sheet 33.SchDoc
size 594 x 420 mm; Scale: 1:1; Обозначение документа: ГУИР.203719.145 Э3; Номер листа: 27; Разраб.: Иванов; Пров.: Петров; Утв.: Сидоров; Наименование организации: ОАО "Концерн "МПО-Гидроприбор"; Наименование изделия 1: Плата; Наименование изделия 2: Схема электрическая; Наименование изделия 3: принципиальная; Нач. отд.: Нач. отд.; Фамилия нач. отд.: Сидоров
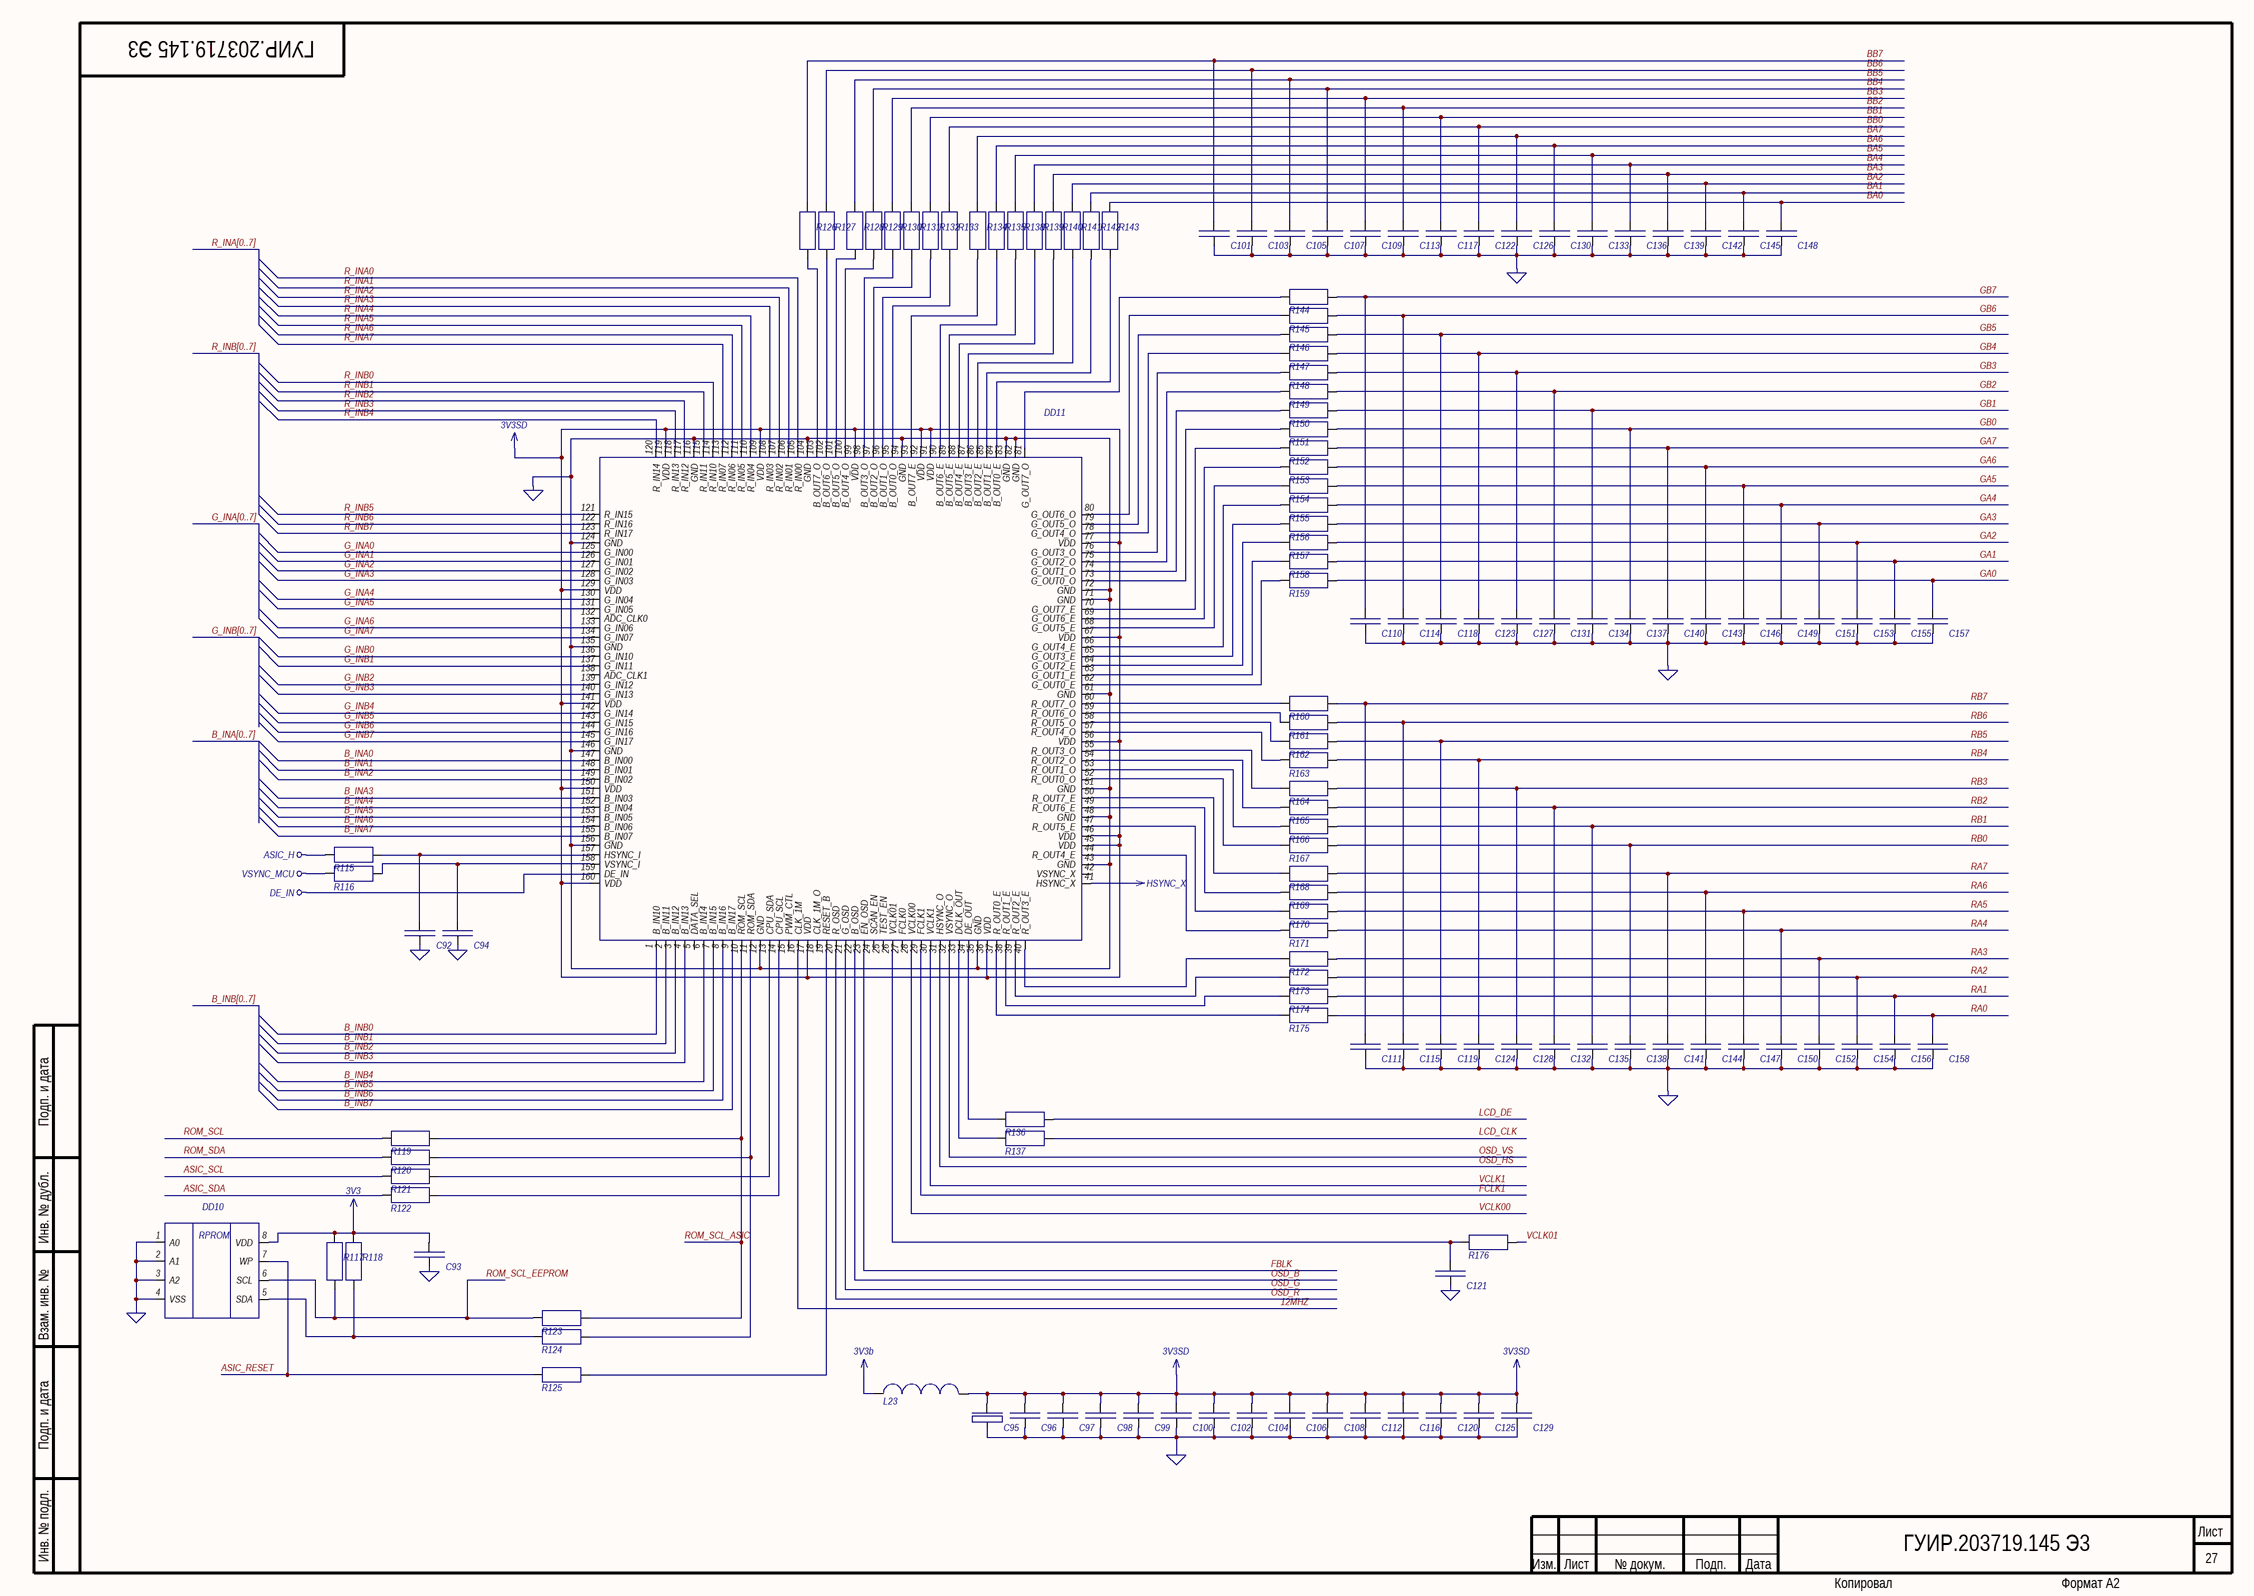
[diagram p2: 33.SchDoc]

### Parts
C92  Capacitor  [cap_electro_13]  (value not drawn)
C93  Capacitor  [cap_electro_13]  (value not drawn)
C94  Capacitor  [cap_electro_13]  (value not drawn)
C95  TuningCapacitor  [Cap_tantal_D]  (value not drawn)
C96  Capacitor  [cap_electro_13]  (value not drawn)
C97  Capacitor  [cap_electro_13]  (value not drawn)
C98  Capacitor  [cap_electro_13]  (value not drawn)
C99  Capacitor  [cap_electro_13]  (value not drawn)
C100  Capacitor  [cap_electro_13]  (value not drawn)
C101  Capacitor  [cap_electro_13]  (value not drawn)
C102  Capacitor  [cap_electro_13]  (value not drawn)
C103  Capacitor  [cap_electro_13]  (value not drawn)
C104  Capacitor  [cap_electro_13]  (value not drawn)
C105  Capacitor  [cap_electro_13]  (value not drawn)
C106  Capacitor  [cap_electro_13]  (value not drawn)
C107  Capacitor  [cap_electro_13]  (value not drawn)
C108  Capacitor  [cap_electro_13]  (value not drawn)
C109  Capacitor  [cap_electro_13]  (value not drawn)
C110  Capacitor  [cap_electro_13]  (value not drawn)
C111  Capacitor  [cap_electro_13]  (value not drawn)
C112  Capacitor  [cap_electro_13]  (value not drawn)
C113  Capacitor  [cap_electro_13]  (value not drawn)
C114  Capacitor  [cap_electro_13]  (value not drawn)
C115  Capacitor  [cap_electro_13]  (value not drawn)
C116  Capacitor  [cap_electro_13]  (value not drawn)
C117  Capacitor  [cap_electro_13]  (value not drawn)
C118  Capacitor  [cap_electro_13]  (value not drawn)
C119  Capacitor  [cap_electro_13]  (value not drawn)
C120  Capacitor  [cap_electro_13]  (value not drawn)
C121  Capacitor  [cap_electro_13]  (value not drawn)
C122  Capacitor  [cap_electro_13]  (value not drawn)
C123  Capacitor  [cap_electro_13]  (value not drawn)
C124  Capacitor  [cap_electro_13]  (value not drawn)
C125  Capacitor  [cap_electro_13]  (value not drawn)
C126  Capacitor  [cap_electro_13]  (value not drawn)
C127  Capacitor  [cap_electro_13]  (value not drawn)
C128  Capacitor  [cap_electro_13]  (value not drawn)
C129  Capacitor  [cap_electro_13]  (value not drawn)
C130  Capacitor  [cap_electro_13]  (value not drawn)
C131  Capacitor  [cap_electro_13]  (value not drawn)
C132  Capacitor  [cap_electro_13]  (value not drawn)
C133  Capacitor  [cap_electro_13]  (value not drawn)
C134  Capacitor  [cap_electro_13]  (value not drawn)
C135  Capacitor  [cap_electro_13]  (value not drawn)
C136  Capacitor  [cap_electro_13]  (value not drawn)
C137  Capacitor  [cap_electro_13]  (value not drawn)
C138  Capacitor  [cap_electro_13]  (value not drawn)
C139  Capacitor  [cap_electro_13]  (value not drawn)
C140  Capacitor  [cap_electro_13]  (value not drawn)
C141  Capacitor  [cap_electro_13]  (value not drawn)
C142  Capacitor  [cap_electro_13]  (value not drawn)
C143  Capacitor  [cap_electro_13]  (value not drawn)
C144  Capacitor  [cap_electro_13]  (value not drawn)
C145  Capacitor  [cap_electro_13]  (value not drawn)
C146  Capacitor  [cap_electro_13]  (value not drawn)
C147  Capacitor  [cap_electro_13]  (value not drawn)
C148  Capacitor  [cap_electro_13]  (value not drawn)
C149  Capacitor  [cap_electro_13]  (value not drawn)
C150  Capacitor  [cap_electro_13]  (value not drawn)
C151  Capacitor  [cap_electro_13]  (value not drawn)
C152  Capacitor  [cap_electro_13]  (value not drawn)
C153  Capacitor  [cap_electro_13]  (value not drawn)
C154  Capacitor  [cap_electro_13]  (value not drawn)
C155  Capacitor  [cap_electro_13]  (value not drawn)
C156  Capacitor  [cap_electro_13]  (value not drawn)
C157  Capacitor  [cap_electro_13]  (value not drawn)
C158  Capacitor  [cap_electro_13]  (value not drawn)
DD10  24LC08  [24Cxx]  (value not drawn)
DD11  SD1210  [SD1210]  (value not drawn)
L23  Inductor  [inductor]  (value not drawn)
R115  Resistor  [R_1206]  (value not drawn)
R116  Resistor  [R_1206]  (value not drawn)
R117  Resistor  [R_1206]  (value not drawn)
R118  Resistor  [R_1206]  (value not drawn)
R119  Resistor  [R_1206]  (value not drawn)
R120  Resistor  [R_1206]  (value not drawn)
R121  Resistor  [R_1206]  (value not drawn)
R122  Resistor  [R_1206]  (value not drawn)
R123  Resistor  [R_1206]  (value not drawn)
R124  Resistor  [R_1206]  (value not drawn)
R125  Resistor  [R_1206]  (value not drawn)
R126  Resistor  [R_1206]  (value not drawn)
R127  Resistor  [R_1206]  (value not drawn)
R128  Resistor  [R_1206]  (value not drawn)
R129  Resistor  [R_1206]  (value not drawn)
R130  Resistor  [R_1206]  (value not drawn)
R131  Resistor  [R_1206]  (value not drawn)
R132  Resistor  [R_1206]  (value not drawn)
R133  Resistor  [R_1206]  (value not drawn)
R134  Resistor  [R_1206]  (value not drawn)
R135  Resistor  [R_1206]  (value not drawn)
R136  Resistor  [R_1206]  (value not drawn)
R137  Resistor  [R_1206]  (value not drawn)
R138  Resistor  [R_1206]  (value not drawn)
R139  Resistor  [R_1206]  (value not drawn)
R140  Resistor  [R_1206]  (value not drawn)
R141  Resistor  [R_1206]  (value not drawn)
R142  Resistor  [R_1206]  (value not drawn)
R143  Resistor  [R_1206]  (value not drawn)
R144  Resistor  [R_1206]  (value not drawn)
R145  Resistor  [R_1206]  (value not drawn)
R146  Resistor  [R_1206]  (value not drawn)
R147  Resistor  [R_1206]  (value not drawn)
R148  Resistor  [R_1206]  (value not drawn)
R149  Resistor  [R_1206]  (value not drawn)
R150  Resistor  [R_1206]  (value not drawn)
R151  Resistor  [R_1206]  (value not drawn)
R152  Resistor  [R_1206]  (value not drawn)
R153  Resistor  [R_1206]  (value not drawn)
R154  Resistor  [R_1206]  (value not drawn)
R155  Resistor  [R_1206]  (value not drawn)
R156  Resistor  [R_1206]  (value not drawn)
R157  Resistor  [R_1206]  (value not drawn)
R158  Resistor  [R_1206]  (value not drawn)
R159  Resistor  [R_1206]  (value not drawn)
R160  Resistor  [R_1206]  (value not drawn)
R161  Resistor  [R_1206]  (value not drawn)
R162  Resistor  [R_1206]  (value not drawn)
R163  Resistor  [R_1206]  (value not drawn)
R164  Resistor  [R_1206]  (value not drawn)
R165  Resistor  [R_1206]  (value not drawn)
R166  Resistor  [R_1206]  (value not drawn)
R167  Resistor  [R_1206]  (value not drawn)
R168  Resistor  [R_1206]  (value not drawn)
R169  Resistor  [R_1206]  (value not drawn)
R170  Resistor  [R_1206]  (value not drawn)
R171  Resistor  [R_1206]  (value not drawn)
R172  Resistor  [R_1206]  (value not drawn)
R173  Resistor  [R_1206]  (value not drawn)
R174  Resistor  [R_1206]  (value not drawn)
R175  Resistor  [R_1206]  (value not drawn)
R176  Resistor  [R_1206]  (value not drawn)

### Nets
3V3: C93.2 DD10.8(VDD) R117.1 R118.1
3V3b: L23.1
3V3SD: C95.1 C96.2 C97.2 C98.2 C99.2 C100.2 C102.2 C104.2 C106.2 C108.2 C112.2 C116.2 C120.2 C125.2 C129.2 DD11.17(VDD) DD11.36(VDD) DD11.45(VDD) DD11.46(VDD) DD11.56(VDD) DD11.67(VDD) DD11.77(VDD) DD11.91(VDD) DD11.92(VDD) DD11.99(VDD) DD11.109(VDD) DD11.119(VDD) DD11.129(VDD) DD11.141(VDD) DD11.150(VDD) DD11.160(VDD) L23.2
ASIC_H: R115.2
ASIC_RESET: DD10.7(WP) R125.2
DE_IN: DD11.159(DE_IN)
FCLK1: DD11.29(FCLK1)
GND: C92.1 C93.1 C94.1 C95.2 C96.1 C97.1 C98.1 C99.1 C100.1 C101.1 C102.1 C103.1 C104.1 C105.1 C106.1 C107.1 C108.1 C109.1 C110.1 C111.1 C112.1 C113.1 C114.1 C115.1 C116.1 C117.1 C118.1 C119.1 C120.1 C121.1 C122.1 C123.1 C124.1 C125.1 C126.1 C127.1 C128.1 C129.1 C130.1 C131.1 C132.1 C133.1 C134.1 C135.1 C136.1 C137.1 C138.1 C139.1 C140.1 C141.1 C142.1 C143.1 C144.1 C145.1 C146.1 C147.1 C148.1 C149.1 C150.1 C151.1 C152.1 C153.1 C154.1 C155.1 C156.1 C157.1 C158.1 DD10.1(A0) DD10.2(A1) DD10.3(A2) DD10.4(VSS) DD11.12(GND) DD11.35(GND) DD11.43(GND) DD11.48(GND) DD11.51(GND) DD11.61(GND) DD11.71(GND) DD11.72(GND) DD11.82(GND) DD11.83(GND) DD11.94(GND) DD11.104(GND) DD11.116(GND) DD11.124(GND) DD11.135(GND) DD11.146(GND) DD11.156(GND)
HSYNC_X: DD11.41(HSYNC_X)
ROM_SCL: R119.2
ROM_SCL_ASIC: DD11.10(ROM_SCL) R119.1 R123.1
VCLK01: R176.1
VCLK1: DD11.30(VCLK1)  [project net OSD_CLK]
VSYNC_MCU: R116.2
12MHZ: DD11.16(CLK_1M)
ASIC_SCL: R121.2
ASIC_SDA: R122.2
B_INA0: DD11.147(B_IN00)
B_INA1: DD11.148(B_IN01)
B_INA2: DD11.149(B_IN02)
B_INA3: DD11.151(B_IN03)
B_INA4: DD11.152(B_IN04)
B_INA5: DD11.153(B_IN05)
B_INA6: DD11.154(B_IN06)
B_INA7: DD11.155(B_IN07)
B_INB0: DD11.1(B_IN10)
B_INB1: DD11.2(B_IN11)
B_INB2: DD11.3(B_IN12)
B_INB3: DD11.4(B_IN13)
B_INB4: DD11.6(B_IN14)
B_INB5: DD11.7(B_IN15)
B_INB6: DD11.8(B_IN16)
B_INB7: DD11.9(B_IN17)
BA0: C148.2 R143.1
BA1: C145.2 R142.1
BA2: C142.2 R141.1
BA3: C139.2 R140.1
BA4: C136.2 R139.1
BA5: C133.2 R138.1
BA6: C130.2 R135.1
BA7: C126.2 R134.1
BB0: C122.2 R133.1
BB1: C117.2 R132.1
BB2: C113.2 R131.1
BB3: C109.2 R130.1
BB4: C107.2 R129.1
BB5: C105.2 R128.1
BB6: C103.2 R127.1
BB7: C101.2 R126.1
FBLK: DD11.23(EN_OSD)
G_INA0: DD11.125(G_IN00)
G_INA1: DD11.126(G_IN01)
G_INA2: DD11.127(G_IN02)
G_INA3: DD11.128(G_IN03)
G_INA4: DD11.130(G_IN04)
G_INA5: DD11.131(G_IN05)
G_INA6: DD11.133(G_IN06)
G_INA7: DD11.134(G_IN07)
G_INB0: DD11.136(G_IN10)
G_INB1: DD11.137(G_IN11)
G_INB2: DD11.139(G_IN12)
G_INB3: DD11.140(G_IN13)
G_INB4: DD11.142(G_IN14)
G_INB5: DD11.143(G_IN15)
G_INB6: DD11.144(G_IN16)
G_INB7: DD11.145(G_IN17)
GA0: C157.2 R159.1
GA1: C155.2 R158.1
GA2: C153.2 R157.1
GA3: C151.2 R156.1
GA4: C149.2 R155.1
GA5: C146.2 R154.1
GA6: C143.2 R153.1
GA7: C140.2 R152.1
GB0: C137.2 R151.1
GB1: C134.2 R150.1
GB2: C131.2 R149.1
GB3: C127.2 R148.1
GB4: C123.2 R147.1
GB5: C118.2 R146.1
GB6: C114.2 R145.1
GB7: C110.2 R144.1
LCD_CLK: R137.1
LCD_DE: R136.1
OSD_B: DD11.22(B_OSD)
OSD_G: DD11.21(G_OSD)
OSD_HS: DD11.31(HSYNC_O)
OSD_R: DD11.20(R_OSD)
OSD_VS: DD11.32(VSYNC_O)
R_INA0: DD11.105(R_IN00)
R_INA1: DD11.106(R_IN01)
R_INA2: DD11.107(R_IN02)
R_INA3: DD11.108(R_IN03)
R_INA4: DD11.110(R_IN04)
R_INA5: DD11.111(R_IN05)
R_INA6: DD11.112(R_IN06)
R_INA7: DD11.113(R_IN07)
R_INB0: DD11.114(R_IN10)
R_INB1: DD11.115(R_IN11)
R_INB2: DD11.117(R_IN12)
R_INB3: DD11.118(R_IN13)
R_INB4: DD11.120(R_IN14)
R_INB5: DD11.121(R_IN15)
R_INB6: DD11.122(R_IN16)
R_INB7: DD11.123(R_IN17)
RA0: C158.2 R175.1
RA1: C156.2 R174.1
RA2: C154.2 R173.1
RA3: C152.2 R172.1
RA4: C150.2 R171.1
RA5: C147.2 R170.1
RA6: C144.2 R169.1
RA7: C141.2 R168.1
RB0: C138.2 R167.1
RB1: C135.2 R166.1
RB2: C132.2 R165.1
RB3: C128.2 R164.1
RB4: C124.2 R163.1
RB5: C119.2 R162.1
RB6: C115.2 R161.1
RB7: C111.2 R160.1
ROM_SCL_EEPROM: DD10.6(SCL) R117.2 R123.2
ROM_SDA: R120.2
VCLK00: DD11.28(VCLK00)
NetC92_2: C92.2 DD11.157(HSYNC_I) R115.1
NetC94_2: C94.2 DD11.158(VSYNC_I) R116.1
NetC121_2: C121.2 DD11.26(VCLK01) R176.2
NetDD10_5: DD10.5(SDA) R118.2 R124.2
NetDD11_11: DD11.11(ROM_SDA) R120.1 R124.1
NetDD11_13: DD11.13(CPU_SDA) R121.1
NetDD11_14: DD11.14(CPU_SCL) R122.1
NetDD11_19: DD11.19(RESET_B) R125.1
NetDD11_33: DD11.33(DCLK_OUT) R137.2
NetDD11_34: DD11.34(DE_OUT) R136.2
NetDD11_37: DD11.37(R_OUT0_E) R175.2
NetDD11_38: DD11.38(R_OUT1_E) R174.2
NetDD11_39: DD11.39(R_OUT2_E) R173.2
NetDD11_40: DD11.40(R_OUT3_E) R172.2
NetDD11_44: DD11.44(R_OUT4_E) R171.2
NetDD11_47: DD11.47(R_OUT5_E) R170.2
NetDD11_49: DD11.49(R_OUT6_E) R169.2
NetDD11_50: DD11.50(R_OUT7_E) R168.2
NetDD11_52: DD11.52(R_OUT0_O) R167.2
NetDD11_53: DD11.53(R_OUT1_O) R166.2
NetDD11_54: DD11.54(R_OUT2_O) R165.2
NetDD11_55: DD11.55(R_OUT3_O) R164.2
NetDD11_57: DD11.57(R_OUT4_O) R163.2
NetDD11_58: DD11.58(R_OUT5_O) R162.2
NetDD11_59: DD11.59(R_OUT6_O) R161.2
NetDD11_60: DD11.60(R_OUT7_O) R160.2
NetDD11_62: DD11.62(G_OUT0_E) R159.2
NetDD11_63: DD11.63(G_OUT1_E) R158.2
NetDD11_64: DD11.64(G_OUT2_E) R157.2
NetDD11_65: DD11.65(G_OUT3_E) R156.2
NetDD11_66: DD11.66(G_OUT4_E) R155.2
NetDD11_68: DD11.68(G_OUT5_E) R154.2
NetDD11_69: DD11.69(G_OUT6_E) R153.2
NetDD11_70: DD11.70(G_OUT7_E) R152.2
NetDD11_73: DD11.73(G_OUT0_O) R151.2
NetDD11_74: DD11.74(G_OUT1_O) R150.2
NetDD11_75: DD11.75(G_OUT2_O) R149.2
NetDD11_76: DD11.76(G_OUT3_O) R148.2
NetDD11_78: DD11.78(G_OUT4_O) R147.2
NetDD11_79: DD11.79(G_OUT5_O) R146.2
NetDD11_80: DD11.80(G_OUT6_O) R145.2
NetDD11_81: DD11.81(G_OUT7_O) R144.2
NetDD11_84: DD11.84(B_OUT0_E) R143.2
NetDD11_85: DD11.85(B_OUT1_E) R142.2
NetDD11_86: DD11.86(B_OUT2_E) R141.2
NetDD11_87: DD11.87(B_OUT3_E) R140.2
NetDD11_88: DD11.88(B_OUT4_E) R139.2
NetDD11_89: DD11.89(B_OUT5_E) R138.2
NetDD11_90: DD11.90(B_OUT6_E) R135.2
NetDD11_93: DD11.93(B_OUT7_E) R134.2
NetDD11_95: DD11.95(B_OUT0_O) R133.2
NetDD11_96: DD11.96(B_OUT1_O) R132.2
NetDD11_97: DD11.97(B_OUT2_O) R131.2
NetDD11_98: DD11.98(B_OUT3_O) R130.2
NetDD11_100: DD11.100(B_OUT4_O) R129.2
NetDD11_101: DD11.101(B_OUT5_O) R128.2
NetDD11_102: DD11.102(B_OUT6_O) R127.2
NetDD11_103: DD11.103(B_OUT7_O) R126.2

Not connected (* = marked no-connect by the designer): DD11 5(DATA_SEL) 15(PWM_CTL) 18(CLK_1M_O) 24(SCAN_EN) 25(TEST_EN) 27(FCLK0) 42(VSYNC_X) 132(ADC_CLK0) 138(ADC_CLK1)

### Buses and harness runs
bus B_INA[0..7]
bus B_INB[0..7]
bus G_INA[0..7]
bus G_INB[0..7]
bus R_INA[0..7]
bus R_INB[0..7]

### Notes on the sheet
- Подп. и дата
- Инв. № дубл.
- Взам. инв. №
- Инв. № подл.
- Изм.
- Лист
- № докум.
- Подп.
- Дата
- Копировал
- Формат А2
- (in symbol 24LC08) RPROM

## Sheet 36.SchDoc
size 594 x 420 mm; Scale: 1:1; Обозначение документа: ГУИР.203719.145 Э3; Номер листа: 28; Общее количество листов: 28
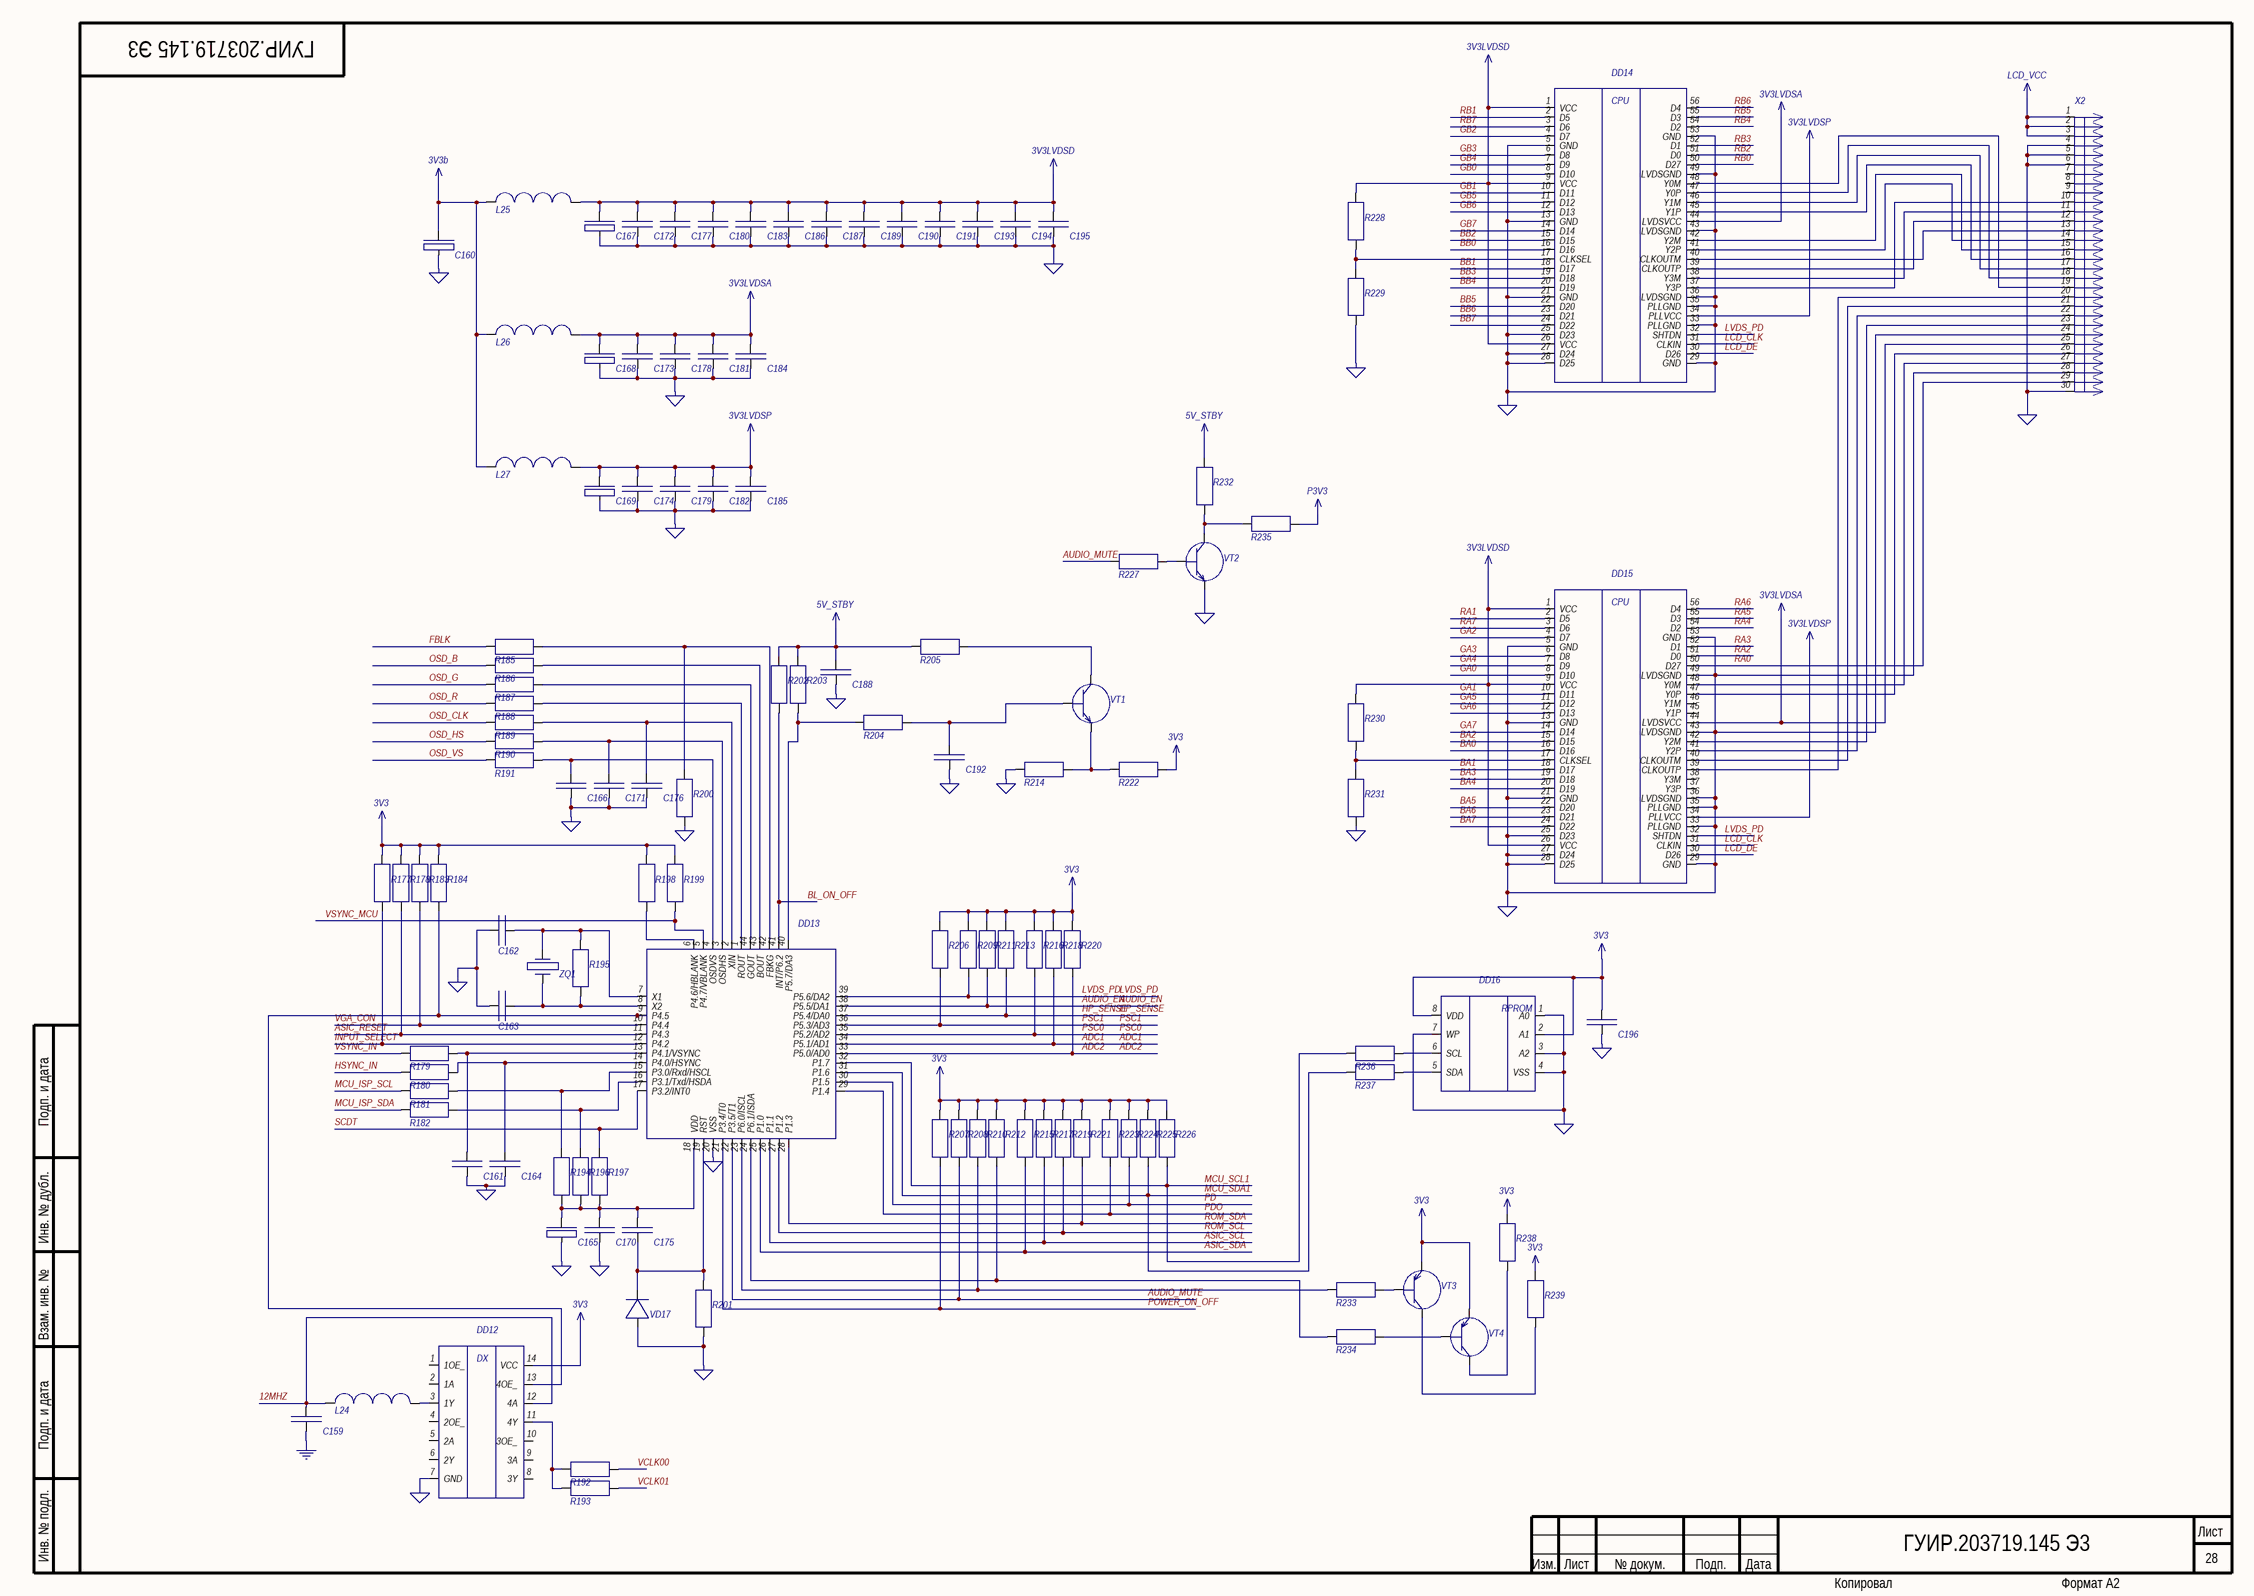
[diagram p3: 36.SchDoc]

### Parts
C159  Capacitor  [cap_electro_13]  (value not drawn)
C160  TuningCapacitor  [Cap_tantal_D]  (value not drawn)
C161  Capacitor  [cap_electro_13]  (value not drawn)
C162  Capacitor  [cap_electro_13]  (value not drawn)
C163  Capacitor  [cap_electro_13]  (value not drawn)
C164  Capacitor  [cap_electro_13]  (value not drawn)
C165  TuningCapacitor  [Cap_tantal_D]  (value not drawn)
C166  Capacitor  [cap_electro_13]  (value not drawn)
C167  TuningCapacitor  [Cap_tantal_D]  (value not drawn)
C168  TuningCapacitor  [Cap_tantal_D]  (value not drawn)
C169  TuningCapacitor  [Cap_tantal_D]  (value not drawn)
C170  Capacitor  [cap_electro_13]  (value not drawn)
C171  Capacitor  [cap_electro_13]  (value not drawn)
C172  Capacitor  [cap_electro_13]  (value not drawn)
C173  Capacitor  [cap_electro_13]  (value not drawn)
C174  Capacitor  [cap_electro_13]  (value not drawn)
C175  Capacitor  [cap_electro_13]  (value not drawn)
C176  Capacitor  [cap_electro_13]  (value not drawn)
C177  Capacitor  [cap_electro_13]  (value not drawn)
C178  Capacitor  [cap_electro_13]  (value not drawn)
C179  Capacitor  [cap_electro_13]  (value not drawn)
C180  Capacitor  [cap_electro_13]  (value not drawn)
C181  Capacitor  [cap_electro_13]  (value not drawn)
C182  Capacitor  [cap_electro_13]  (value not drawn)
C183  Capacitor  [cap_electro_13]  (value not drawn)
C184  Capacitor  [cap_electro_13]  (value not drawn)
C185  Capacitor  [cap_electro_13]  (value not drawn)
C186  Capacitor  [cap_electro_13]  (value not drawn)
C187  Capacitor  [cap_electro_13]  (value not drawn)
C188  Capacitor  [cap_electro_13]  (value not drawn)
C189  Capacitor  [cap_electro_13]  (value not drawn)
C190  Capacitor  [cap_electro_13]  (value not drawn)
C191  Capacitor  [cap_electro_13]  (value not drawn)
C192  Capacitor  [cap_electro_13]  (value not drawn)
C193  Capacitor  [cap_electro_13]  (value not drawn)
C194  Capacitor  [cap_electro_13]  (value not drawn)
C195  Capacitor  [cap_electro_13]  (value not drawn)
C196  Capacitor  [cap_electro_13]  (value not drawn)
DD12  74LCX125  [74LCX125(page12)]  (value not drawn)
DD13  SM0230  [SM0230]  (value not drawn)
DD14  SN75LVDS83  [SN75LVDS83_v2]  (value not drawn)
DD15  SN75LVDS83  [SN75LVDS83_v2]  (value not drawn)
DD16  24LC16  [24Cxx]  (value not drawn)
L24  Inductor  [inductor]  (value not drawn)
L25  Inductor  [inductor]  (value not drawn)
L26  Inductor  [inductor]  (value not drawn)
L27  Inductor  [inductor]  (value not drawn)
R177  Resistor  [R_1206]  (value not drawn)
R178  Resistor  [R_1206]  (value not drawn)
R179  Resistor  [R_1206]  (value not drawn)
R180  Resistor  [R_1206]  (value not drawn)
R181  Resistor  [R_1206]  (value not drawn)
R182  Resistor  [R_1206]  (value not drawn)
R183  Resistor  [R_1206]  (value not drawn)
R184  Resistor  [R_1206]  (value not drawn)
R185  Resistor  [R_1206]  (value not drawn)
R186  Resistor  [R_1206]  (value not drawn)
R187  Resistor  [R_1206]  (value not drawn)
R188  Resistor  [R_1206]  (value not drawn)
R189  Resistor  [R_1206]  (value not drawn)
R190  Resistor  [R_1206]  (value not drawn)
R191  Resistor  [R_1206]  (value not drawn)
R192  Resistor  [R_1206]  (value not drawn)
R193  Resistor  [R_1206]  (value not drawn)
R194  Resistor  [R_1206]  (value not drawn)
R195  Resistor  [R_1206]  (value not drawn)
R196  Resistor  [R_1206]  (value not drawn)
R197  Resistor  [R_1206]  (value not drawn)
R198  Resistor  [R_1206]  (value not drawn)
R199  Resistor  [R_1206]  (value not drawn)
R200  Resistor  [R_1206]  (value not drawn)
R201  Resistor  [R_1206]  (value not drawn)
R202  Resistor  [R_1206]  (value not drawn)
R203  Resistor  [R_1206]  (value not drawn)
R204  Resistor  [R_1206]  (value not drawn)
R205  Resistor  [R_1206]  (value not drawn)
R206  Resistor  [R_1206]  (value not drawn)
R207  Resistor  [R_1206]  (value not drawn)
R208  Resistor  [R_1206]  (value not drawn)
R209  Resistor  [R_1206]  (value not drawn)
R210  Resistor  [R_1206]  (value not drawn)
R211  Resistor  [R_1206]  (value not drawn)
R212  Resistor  [R_1206]  (value not drawn)
R213  Resistor  [R_1206]  (value not drawn)
R214  Resistor  [R_1206]  (value not drawn)
R215  Resistor  [R_1206]  (value not drawn)
R216  Resistor  [R_1206]  (value not drawn)
R217  Resistor  [R_1206]  (value not drawn)
R218  Resistor  [R_1206]  (value not drawn)
R219  Resistor  [R_1206]  (value not drawn)
R220  Resistor  [R_1206]  (value not drawn)
R221  Resistor  [R_1206]  (value not drawn)
R222  Resistor  [R_1206]  (value not drawn)
R223  Resistor  [R_1206]  (value not drawn)
R224  Resistor  [R_1206]  (value not drawn)
R225  Resistor  [R_1206]  (value not drawn)
R226  Resistor  [R_1206]  (value not drawn)
R227  Resistor  [R_1206]  (value not drawn)
R228  Resistor  [R_1206]  (value not drawn)
R229  Resistor  [R_1206]  (value not drawn)
R230  Resistor  [R_1206]  (value not drawn)
R231  Resistor  [R_1206]  (value not drawn)
R232  Resistor  [R_1206]  (value not drawn)
R233  Resistor  [R_1206]  (value not drawn)
R234  Resistor  [R_1206]  (value not drawn)
R235  Resistor  [R_1206]  (value not drawn)
R236  Resistor  [R_1206]  (value not drawn)
R237  Resistor  [R_1206]  (value not drawn)
R238  Resistor  [R_1206]  (value not drawn)
R239  Resistor  [R_1206]  (value not drawn)
VD17  Diode  [zener_diode]  (value not drawn)
VT1  MMBT3904L  [MMBT3904L]  (value not drawn)
VT2  MMBT3904L  [MMBT3904L]  (value not drawn)
VT3  2N3906  [2N3906]  (value not drawn)
VT4  2N3906  [2N3906]  (value not drawn)
X2  FI-SE30P-HF  [FI-SE30P-HF_v2]  (value not drawn)
ZQ1  Crystal  [crystal]  (value not drawn)

### Nets
3V3: C196.1 DD12.14(VCC) DD16.2(A1) DD16.8(VDD) R177.2 R178.2 R183.2 R184.2 R198.2 R199.2 R206.1 R207.1 R208.1 R209.1 R210.1 R211.1 R212.1 R213.1 R215.1 R216.1 R217.1 R218.1 R219.1 R220.1 R221.1 R222.2 R223.1 R224.1 R225.1 R226.1 R238.2 R239.2 VT3.2(Emitter) VT4.2(Emitter)
3V3b: C160.1 L25.1 L26.1 L27.1
3V3LVDSA: C168.1 C173.2 C178.2 C181.2 C184.2 DD14.44(LVDSVCC) DD15.44(LVDSVCC) L26.2 X2.25(RXEIN2-)
3V3LVDSD: C167.1 C172.2 C177.2 C180.2 C183.2 C186.2 C187.2 C189.2 C190.2 C191.2 C193.2 C194.2 C195.2 DD14.1(VCC) DD14.9(VCC) DD14.26(VCC) DD15.1(VCC) DD15.9(VCC) DD15.26(VCC) L25.2 R228.2 R230.2
3V3LVDSP: C169.1 C174.2 C179.2 C182.2 C185.2 DD14.34(PLLVCC) DD15.34(PLLVCC) L27.2
5V_STBY: C188.1 R202.1 R203.1 R205.1 R232.2
ASIC_RESET: DD13.11(P4.3) R178.1
GND: C159.2 C160.2 C161.1 C162.2 C163.2 C164.1 C165.2 C166.2 C167.2 C168.2 C169.2 C170.1 C171.2 C172.1 C173.1 C174.1 C176.2 C177.1 C178.1 C179.1 C180.1 C181.1 C182.1 C183.1 C184.1 C185.1 C186.1 C187.1 C188.2 C189.1 C190.1 C191.1 C192.2 C193.1 C194.1 C195.1 C196.2 DD12.7(GND) DD13.20(VSS) DD14.5(GND) DD14.13(GND) DD14.21(GND) DD14.25(D23) DD14.27(D24) DD14.28(D25) DD14.29(GND) DD14.33(PLLGND) DD14.35(PLLGND) DD14.36(LVDSGND) DD14.43(LVDSGND) DD14.49(LVDSGND) DD14.53(GND) DD15.5(GND) DD15.13(GND) DD15.21(GND) DD15.25(D23) DD15.27(D24) DD15.28(D25) DD15.29(GND) DD15.33(PLLGND) DD15.35(PLLGND) DD15.36(LVDSGND) DD15.43(LVDSGND) DD15.49(LVDSGND) DD15.53(GND) DD16.1(A0) DD16.3(A2) DD16.4(VSS) DD16.7(WP) R200.1 R201.1 R214.1 R229.1 R231.1 VD17.1 VT2.2(Emitter) X2.4(GND) X2.5(GND) X2.6(GND) X2.24(RXEIN2+) X2.28(RXEIN0+) X2.30(LVDSGND)
INPUT_SELECT: DD13.12(P4.2) R177.1
LCD_VCC: X2.1(VIN) X2.2(VIN) X2.3(VIN)
OSD_CLK: R189.2
P3V3: R235.2
ROM_SCL: DD13.27(P1.2) R219.2
VCLK01: R193.2
VSYNC_MCU: DD13.5(P4.7/VBLANK) R199.1
12MHZ: C159.1 DD12.12(4A) L24.1
ADC1: DD13.34(P5.1/AD1) R218.2
ADC2: DD13.33(P5.0/AD0) R220.2
ASIC_SCL: DD13.26(P1.1) R217.2
ASIC_SDA: DD13.25(P1.0) R215.2
AUDIO_EN: DD13.38(P5.5/DA1) R211.2
AUDIO_MUTE: DD13.22(P3.5/T1) R208.2 R227.1
BA0: DD15.16(D16)
BA1: DD15.18(D17)
BA2: DD15.15(D15)
BA3: DD15.19(D18)
BA4: DD15.20(D19)
BA5: DD15.22(D20)
BA6: DD15.23(D21)
BA7: DD15.24(D22)
BB0: DD14.16(D16)
BB1: DD14.18(D17)
BB2: DD14.15(D15)
BB3: DD14.19(D18)
BB4: DD14.20(D19)
BB5: DD14.22(D20)
BB6: DD14.23(D21)
BB7: DD14.24(D22)
BL_ON_OFF: DD13.41(INT/P6.2) R202.2
FBLK: R185.2
GA0: DD15.8(D10)
GA1: DD15.10(D11)
GA2: DD15.4(D7)
GA3: DD15.6(D8)
GA4: DD15.7(D9)
GA5: DD15.11(D12)
GA6: DD15.12(D13)
GA7: DD15.14(D14)
GB0: DD14.8(D10)
GB1: DD14.10(D11)
GB2: DD14.4(D7)
GB3: DD14.6(D8)
GB4: DD14.7(D9)
GB5: DD14.11(D12)
GB6: DD14.12(D13)
GB7: DD14.14(D14)
HP_SENSE: DD13.37(P5.4/DA0) R213.2
HSYNC_IN: R180.1
LCD_CLK: DD14.31(CLKIN) DD15.31(CLKIN)
LCD_DE: DD14.30(D26) DD15.30(D26)
LVDS_PD: DD13.39(P5.6/DA2) DD14.32(SHTDN) DD15.32(SHTDN) R209.2
MCU_ISP_SCL: R181.1
MCU_ISP_SDA: R182.1
MCU_SCL1: DD13.32(P1.7) R226.2 R236.1
MCU_SDA1: DD13.31(P1.6) R225.2 R237.1
OSD_B: R186.2
OSD_G: R187.2
OSD_HS: R190.2
OSD_R: R188.2
OSD_VS: R191.2
PD: DD13.30(P1.5) R224.2
PDO: DD13.29(P1.4) R223.2
POWER_ON_OFF: DD13.21(P3.4/T0) R207.2
PSC0: DD13.35(P5.2/AD2) R216.2
PSC1: DD13.36(P5.3/AD3) R206.2
RA0: DD15.50(D27) X2.29(RXEIN0-)
RA1: DD15.2(D5)
RA2: DD15.51(D0)
RA3: DD15.52(D1)
RA4: DD15.54(D2)
RA5: DD15.55(D3)
RA6: DD15.56(D4)
RA7: DD15.3(D6)
RB0: DD14.50(D27)
RB1: DD14.2(D5)
RB2: DD14.51(D0)
RB3: DD14.52(D1)
RB4: DD14.54(D2)
RB5: DD14.55(D3)
RB6: DD14.56(D4)
RB7: DD14.3(D6)
ROM_SDA: DD13.28(P1.3) R221.2
SCDT: DD13.17(P3.2/INT0) R197.2
VCLK00: R192.2
VGA_CON: DD13.10(P4.4) R183.1
VSYNC_IN: R179.1
NetC161_2: C161.2 DD13.13(P4.1/VSYNC) R179.2
NetC162_1: C162.1 DD13.7(X1) R195.2 ZQ1.2
NetC163_1: C163.1 DD13.8(X2) R195.1 ZQ1.1
NetC164_2: C164.2 DD13.14(P4.0/HSYNC) R180.2
NetC165_1: C165.1 C170.2 C175.2 DD13.18(VDD) R194.1 R196.1 R197.1
NetC166_1: C166.1 DD13.4(OSDVS) R191.1
NetC171_1: C171.1 DD13.3(OSDHS) R190.1
NetC175_1: C175.1 DD13.19(RST) R201.2 VD17.2
NetC176_1: C176.1 DD13.2(XIN) R189.1
NetC192_1: C192.1 R204.2 VT1.1(Base)
NetDD12_3: DD12.3(1Y) L24.2
NetDD12_11: DD12.11(4Y) R192.1 R193.1
NetDD12_13: DD12.13(4OE_) DD13.9(P4.5) R184.1
NetDD13_1: DD13.1(ROUT) R188.1
NetDD13_6: DD13.6(P4.6/HBLANK) R198.1
NetDD13_15: DD13.15(P3.0/Rxd/HSCL) R181.2 R194.2
NetDD13_16: DD13.16(P3.1/Txd/HSDA) R182.2 R196.2
NetDD13_23: DD13.23(P6.0/ISCL) R210.2 R233.1
NetDD13_24: DD13.24(P6.1/ISDA) R212.2 R234.1
NetDD13_40: DD13.40(P5.7/DA3) R203.2 R204.1
NetDD13_42: DD13.42(FBKG) R185.1 R200.2
NetDD13_43: DD13.43(BOUT) R186.1
NetDD13_44: DD13.44(GOUT) R187.1
NetDD14_17: DD14.17(CLKSEL) R228.1 R229.2
NetDD14_37: DD14.37(Y3P) X2.10(RXOIN3+)
NetDD14_38: DD14.38(Y3M) X2.11(RXOIN3-)
NetDD14_39: DD14.39(CLKOUTP) X2.12(RXOCLKIN+)
NetDD14_40: DD14.40(CLKOUTM) X2.13(RXOCLKIN-)
NetDD14_41: DD14.41(Y2P) X2.14(RXOIN2+)
NetDD14_42: DD14.42(Y2M) X2.15(RXOIN2-)
NetDD14_45: DD14.45(Y1P) X2.16(RXOIN1+)
NetDD14_46: DD14.46(Y1M) X2.17(RXOIN1-)
NetDD14_47: DD14.47(Y0P) X2.18(RXOIN0+)
NetDD14_48: DD14.48(Y0M) X2.19(RXOIN0-)
NetDD15_17: DD15.17(CLKSEL) R230.1 R231.2
NetDD15_39: DD15.39(CLKOUTP) X2.20(RXEIN3+)
NetDD15_40: DD15.40(CLKOUTM) X2.21(RXEIN3-)
NetDD15_41: DD15.41(Y2P) X2.22(RXECLKIN+)
NetDD15_42: DD15.42(Y2M) X2.23(RXECLKIN-)
NetDD15_47: DD15.47(Y0P) X2.26(RXEIN1+)
NetDD15_48: DD15.48(Y0M) X2.27(RXEIN1-)
NetDD16_5: DD16.5(SDA) R237.2
NetDD16_6: DD16.6(SCL) R236.2
NetR205_2: R205.2 VT1.3(Collector)
NetR214_2: R214.2 R222.1 VT1.2(Emitter)
NetR227_2: R227.2 VT2.1(Base)
NetR232_1: R232.1 R235.1 VT2.3(Collector)
NetR233_2: R233.2 VT3.1(Base)
NetR234_2: R234.2 VT4.1(Base)
NetR238_1: R238.1 VT4.3(Collector)
NetR239_1: R239.1 VT3.3(Collector)

Not connected (* = marked no-connect by the designer): DD12 1(1OE_) 2(1A) 4(2OE_) 5(2A) 6(2Y) 8(3Y) 9(3A) 10(3OE_); DD15 37(Y3P) 38(Y3M) 45(Y1P) 46(Y1M); X2 7(SELLVDS) 8(VcontIN) 9(DGND)

### Notes on the sheet
- Подп. и дата
- Инв. № дубл.
- Взам. инв. №
- Инв. № подл.
- Изм.
- Лист
- № докум.
- Подп.
- Дата
- Копировал
- Формат А2
- (in symbol 24LC16) RPROM
- (in symbol 74LCX125) DX
- (in symbol SN75LVDS83) CPU